# Altium project 200306 Discharge Module R2.PrjPcb
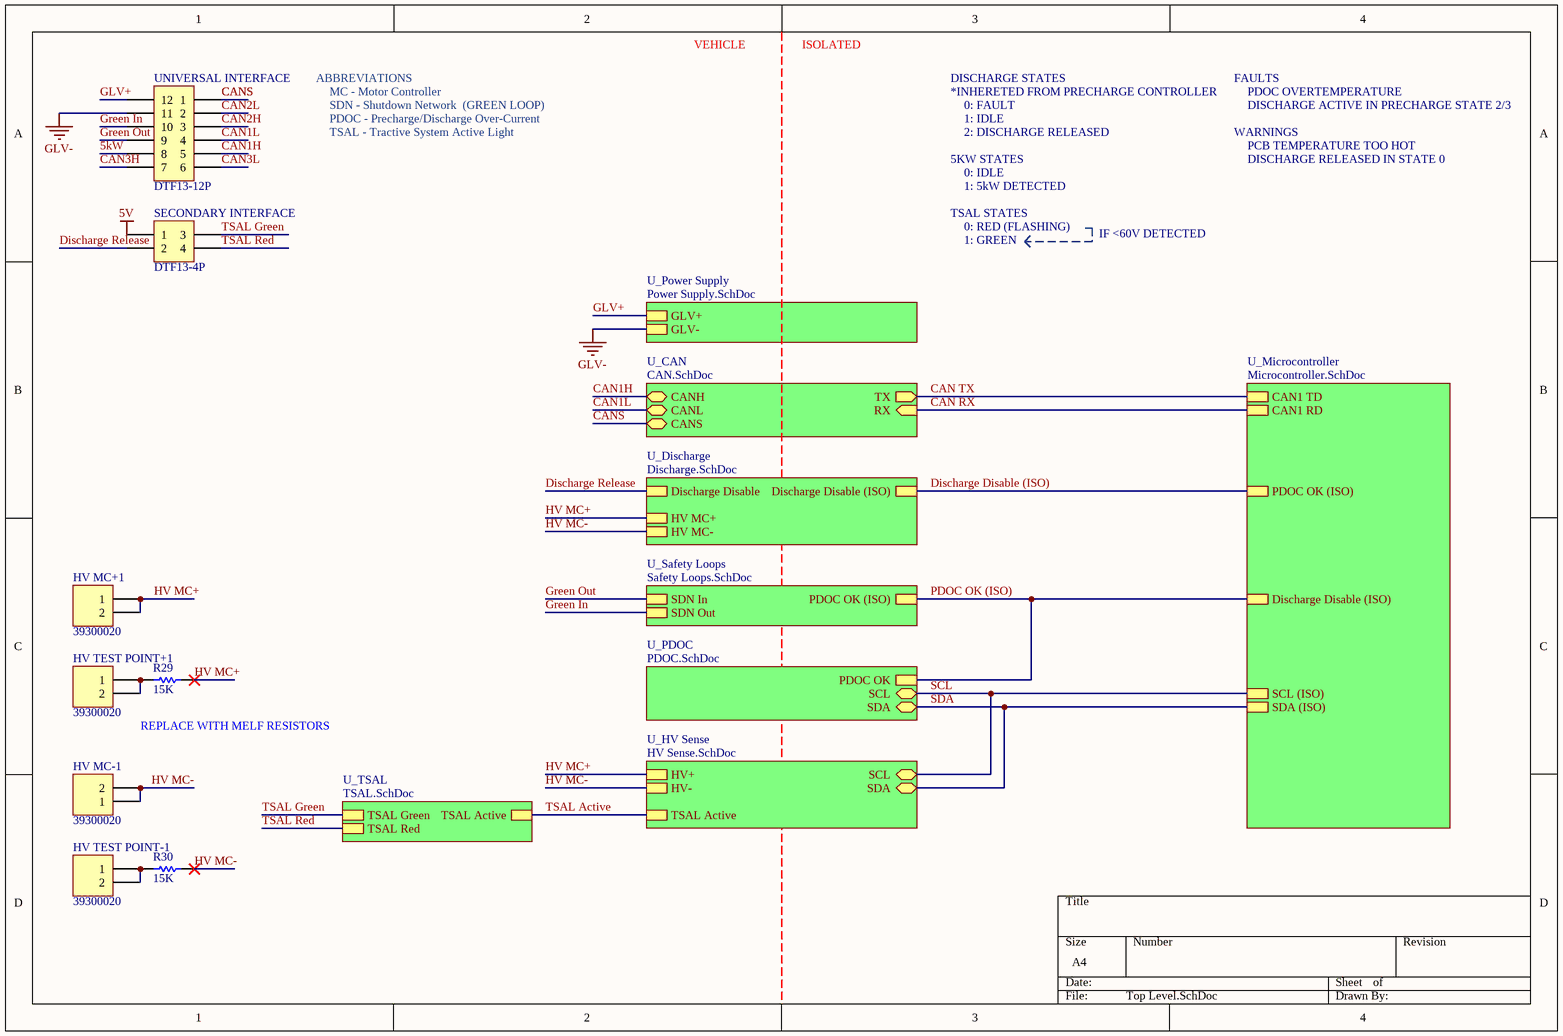
[diagram p0: Top Level.SchDoc]
9 sheets, 198 parts. Net scope: hierarchical (ports join the sheet entries above them; power ports are global).
Board file: PCB.PcbDoc
Sheets:
  Top Level.SchDoc
    U_CAN = CAN.SchDoc
    U_Power Supply = Power Supply.SchDoc
    U_Microcontroller = Microcontroller.SchDoc
    U_TSAL = TSAL.SchDoc
    U_Discharge = Discharge.SchDoc
    U_Safety Loops = Safety Loops.SchDoc
    U_PDOC = PDOC.SchDoc
    U_HV Sense = HV Sense.SchDoc

## Sheet Top Level.SchDoc
size A4

### Parts
HV_MC+1  39300020  [39300020]
HV_MC-1  39300020  [39300020]
HV_TEST_POINT+1  39300020  [39300020]
HV_TEST_POINT-1  39300020  [39300020]
R29  15K  [VB 0204]
R30  15K  [VB 0204]
SECONDARY_INTERFACE  DTF13-4P  [DTF13-4P]
UNIVERSAL_INTERFACE  DTF13-12P  [DTF13-12P]

### Sub-sheets
U_CAN = CAN.SchDoc: CANS (bidir), RX (in), CANL (bidir), CANH (bidir), TX (out)
U_Discharge = Discharge.SchDoc: HV MC+, HV MC-, Discharge Disable, Discharge Disable (ISO)
U_HV Sense = HV Sense.SchDoc: HV+, HV-, SCL (bidir), SDA (bidir), TSAL Active
U_Microcontroller = Microcontroller.SchDoc: CAN1 RD, CAN1 TD, PDOC OK (ISO), Discharge Disable (ISO), SDA (ISO), SCL (ISO)
U_PDOC = PDOC.SchDoc: SCL (bidir), SDA (bidir), PDOC OK
U_Power Supply = Power Supply.SchDoc: GLV+, GLV-
U_Safety Loops = Safety Loops.SchDoc: SDN In, SDN Out, PDOC OK (ISO)
U_TSAL = TSAL.SchDoc: TSAL Active, TSAL Green, TSAL Red

### Nets
5V: SECONDARY_INTERFACE.1
GLV-: UNIVERSAL_INTERFACE.11 ; sheet U_Power Supply/GLV-
HV MC-: HV_MC-1.1 HV_MC-1.2 R30.2 ; sheet U_Discharge/HV MC-, sheet U_HV Sense/HV-
5kW: UNIVERSAL_INTERFACE.8
CAN1H: UNIVERSAL_INTERFACE.5 ; sheet U_CAN/CANH
CAN1L: UNIVERSAL_INTERFACE.4 ; sheet U_CAN/CANL
CAN2H: UNIVERSAL_INTERFACE.3
CAN2L: UNIVERSAL_INTERFACE.2
CAN3H: UNIVERSAL_INTERFACE.7
CAN3L: UNIVERSAL_INTERFACE.6
CAN RX: sheet U_CAN/RX, sheet U_Microcontroller/CAN1 RD
CAN TX: sheet U_CAN/TX, sheet U_Microcontroller/CAN1 TD
CANS: UNIVERSAL_INTERFACE.1 ; sheet U_CAN/CANS
Discharge Disable (ISO): sheet U_Microcontroller/PDOC OK (ISO), sheet U_Discharge/Discharge Disable (ISO)
Discharge Release: SECONDARY_INTERFACE.2 ; sheet U_Discharge/Discharge Disable
GLV+: UNIVERSAL_INTERFACE.12 ; sheet U_Power Supply/GLV+
Green In: UNIVERSAL_INTERFACE.10 ; sheet U_Safety Loops/SDN Out
Green Out: UNIVERSAL_INTERFACE.9 ; sheet U_Safety Loops/SDN In
HV MC+: HV_MC+1.1 HV_MC+1.2 R29.2 ; sheet U_Discharge/HV MC+, sheet U_HV Sense/HV+
PDOC OK (ISO): sheet U_Microcontroller/Discharge Disable (ISO), sheet U_Safety Loops/PDOC OK (ISO), sheet U_PDOC/PDOC OK
SCL: sheet U_Microcontroller/SCL (ISO), sheet U_PDOC/SCL, sheet U_HV Sense/SCL
SDA: sheet U_Microcontroller/SDA (ISO), sheet U_PDOC/SDA, sheet U_HV Sense/SDA
TSAL Active: sheet U_TSAL/TSAL Active, sheet U_HV Sense/TSAL Active
TSAL Green: SECONDARY_INTERFACE.3 ; sheet U_TSAL/TSAL Green
TSAL Red: SECONDARY_INTERFACE.4 ; sheet U_TSAL/TSAL Red
NetHV_TEST_POINT+1_1: HV_TEST_POINT+1.1 HV_TEST_POINT+1.2 R29.1
NetHV_TEST_POINT-1_1: HV_TEST_POINT-1.1 HV_TEST_POINT-1.2 R30.1

### Notes on the sheet
- ABBREVIATIONS
- SDN - Shutdown Network  (GREEN LOOP)
- MC - Motor Controller
- VEHICLE
- ISOLATED
- DISCHARGE STATES
- *INHERETED FROM PRECHARGE CONTROLLER
- 0: FAULT
- FAULTS
- PDOC OVERTEMPERATURE
- DISCHARGE ACTIVE IN PRECHARGE STATE 2/3
- PDOC - Precharge/Discharge Over-Current
- TSAL - Tractive System Active Light
- 5KW STATES
- 1: IDLE
- 2: DISCHARGE RELEASED
- 0: IDLE
- WARNINGS
- PCB TEMPERATURE TOO HOT
- DISCHARGE RELEASED IN STATE 0
- TSAL STATES
- 1: 5kW DETECTED
- 0: RED (FLASHING)
- 1: GREEN
- IF <60V DETECTED
- REPLACE WITH MELF RESISTORS

### Library data of the parts
HV_MC+1 HV_MC-1 HV_TEST_POINT+1 HV_TEST_POINT-1 = 39300020: Positions: 2; Pitch: 4.2mm; Row Spacing: 5.5mm; Angle: 90; Flange: No; Contact: Tin; Part Number: 39300020; Digikey Part Number: WM21351-ND
R29 R30 = MMA02040C1502FB300: Manufacturer: Vishay Beyschlag; Tolerance: 0.01; Rated Voltage: 0.4W; Part Number: MMA02040C1502FB300; Value: 15K; Digikey Part Number: MMA-15KACT-ND
SECONDARY_INTERFACE = DTF13-4P[[/\]]DTF13-4P: Positions: 4; Pitch: 9.12mm; Row Spacing: 4.45mm; Angle: 90; Flange: Yes; Contact: Copper Alloy; Part Number: DTF13-4P; Digikey Part Number: 1734-1646-ND; Digikey Link: https://www.digikey.com.au/products/en?keywords=dtf13-4p
UNIVERSAL_INTERFACE = DTF13-12P[[/\]]DTF13-12P: Positions: 12; Pitch: 4.45mm; Angle: 90; Flange: No; Contact: Copper Alloy; Part Number: DTF13-12P; Row Spacing: 4.45mm; Digikey Part Number: 1734-1861-ND; Digikey Link: https://www.digikey.com/products/en?keywords=dtf13-12pa

## Sheet CAN.SchDoc
size A4
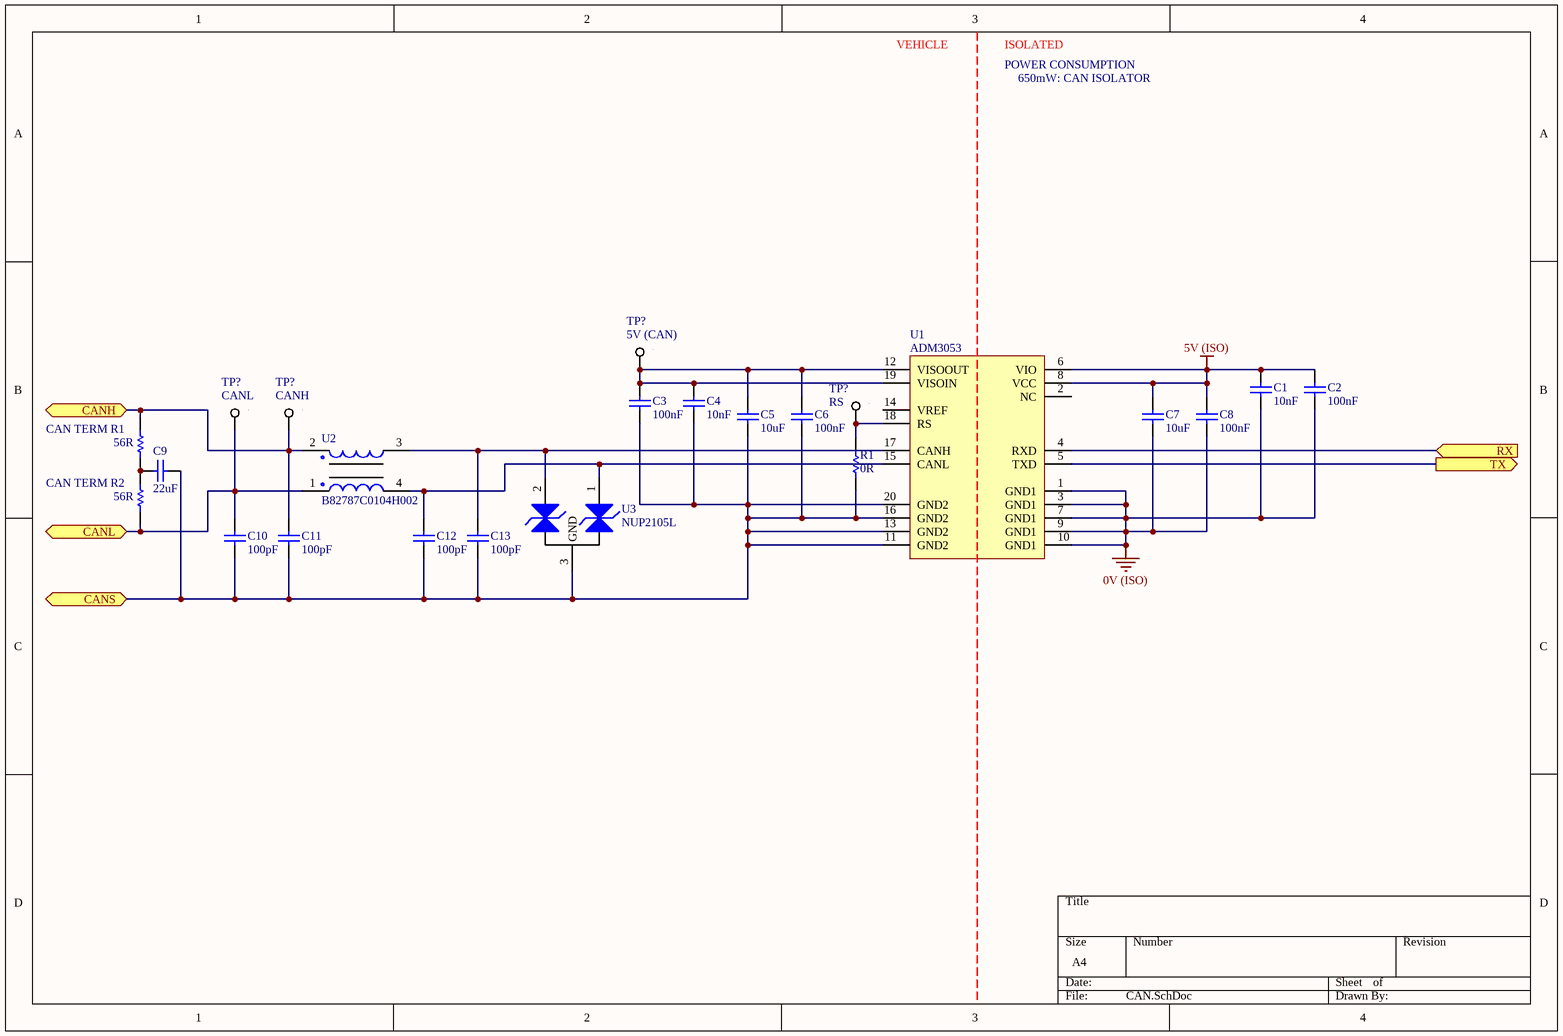
[diagram p1: CAN.SchDoc]

### Parts
(Parts that share a designator on the sheet are numbered #1, #2 ... from top to bottom, then left to right.)
C1  10nF  [1206]
C2  100nF  [0805]
C3  100nF  [0805]
C4  10nF  [1206]
C5  10uF  [0805]
C6  100nF  [0805]
C7  10uF  [0805]
C8  100nF  [0805]
C9  22uF  [1206]
C10  100pF  [0805]
C11  100pF  [0805]
C12  100pF  [0805]
C13  100pF  [0805]
CAN_TERM_R1  56R  [0805]
CAN_TERM_R2  56R  [0805]
R1  0R  [0805]
TP?#1  5V (CAN)  [SMD Test Point 1mm]
TP?#2  RS  [SMD Test Point 1mm]
TP?#3  CANL  [SMD Test Point 1mm]
TP?#4  CANH  [SMD Test Point 1mm]
U1  ADM3053  [AD SOIC-W 20]
U2  B82787C0104H002  [TDK 4-PC Pad]
U3  NUP2105L  [ON SOT-23]

### Ports
CANH (bidir), CANL (bidir), CANS (bidir), RX (in), TX (out)

### Nets
0V (ISO): C1.1 C2.1 C7.1 C8.1 U1.1(GND1) U1.3(GND1) U1.7(GND1) U1.9(GND1) U1.10(GND1)
5V (ISO): C1.2 C2.2 C7.2 C8.2 U1.6(VIO) U1.8(VCC)
CAN1H: C11.2 CAN_TERM_R1.2 TP?#4.1 U2.2 ; port CANH
CAN1L: C10.2 CAN_TERM_R2.1 TP?#3.1 U2.1 ; port CANL
CAN RX: U1.4(RXD) ; port RX
CAN TX: U1.5(TXD) ; port TX
CANS: C3.1 C4.1 C5.1 C6.1 C9.1 C10.1 C11.1 C12.1 C13.1 R1.1 U1.11(GND2) U1.13(GND2) U1.16(GND2) U1.20(GND2) U3.3(GND) ; port CANS
NetC3_2: C3.2 C4.2 C5.2 C6.2 TP?#1.1 U1.12(VISOOUT) U1.19(VISOIN)
NetC9_2: C9.2 CAN_TERM_R1.1 CAN_TERM_R2.2
NetC12_2: C12.2 U1.15(CANL) U2.4 U3.1(CAN_H)
NetC13_2: C13.2 U1.17(CANH) U2.3 U3.2(CAN_L)
NetR1_2: R1.2 TP?#2.1 U1.18(RS)

Not connected (* = marked no-connect by the designer): U1 2(NC) 14(VREF)

### Notes on the sheet
- VEHICLE
- ISOLATED
- POWER CONSUMPTION
- 650mW: CAN ISOLATOR

### Library data of the parts
C1 C4 = GCM3195C2A103JA16D: Manufacturer: muRata; Tolerance: 5%; Material: Ceramic; Rated Voltage: 100V; Part Number: GCM3195C2A103JA16D; Value: 10nF; Digikey Part Number: 490-4978-2-ND
C2 C3 C6 C8 = GCM21BR71H104KA37L: Manufacturer: muRata; Tolerance: ±10%; Material: X7R; Rated Voltage: 50V; Part Number: GCM21BR71H104KA37L; Value: 100nF; Digikey Part Number: 490-6064-1-ND
C5 C7 = GRM21BR6YA106KE43L: Manufacturer: muRata; Tolerance: 10%; Material: X5R; Rated Voltage: 50V; Part Number: GRM21BR6YA106KE43L; Value: 10uF; Digikey Part Number: 490-10514-6-ND
C9 = CC1206MKX5R7BB226: Manufacturer: YAGEO; Tolerance: 20%; Material: Ceramic; Rated Voltage: 16V; Part Number: CC1206MKX5R7BB226; Value: 22uF; Digikey Part Number: 311-1997-2-ND
C10-C13 = GCM2165C1H101JA16D: Manufacturer: muRata; Tolerance: ±5%; Material: C0G, NP0; Rated Voltage: 50V; Part Number: GCM2165C1H101JA16D; Value: 100pF; Digikey Part Number: 490-8031-1-ND
CAN_TERM_R1 CAN_TERM_R2 = RC0805FR0756RL: Manufacturer: YAGEO; Tolerance: 0.01; Rated Voltage: 0.125W; Part Number: RC0805FR0756RL; Value: 56R; Material: FR-07; Digikey Part Number: 311-56.0CRCT-ND
R1 = RC0805FR070RL: Manufacturer: YAGEO; Tolerance: 0.01; Rated Voltage: 0.125W; Part Number: RC0805FR070RL; Value: 0R; Material: FR-07; Digikey Part Number: 311-0.0CRCT-ND
TP?#1-TP?#4 = SMD Test Point Small: Positions: 1; Pitch: 0mm; Row Spacing: 0; Flange: No; Contact: NA; Part Number: SMD Test Point Small; Angle: 0
U1 = ADM3053: Isolated CAN Transceiver; Manufacturer: Analogue Devices; Part Number: ADM3053; Digikey Part Number: ADM3053BRWZ-ND; Digikey Link: https://www.digikey.com/product-detail/en/analog-devices-inc/ADM3053BRWZ/ADM3053BRWZ-ND/2709332
U2 = B82787C0104H002: 100µH @ 100kHz 2 Line Common Mode Choke Surface Mount 5.8 kOhms @ 10MHz 150mA DCR 2Ohm; Manufacturer: EPCOS (TDK); Part Number: B82787C0104H002; Inductance: 100µH @ 100kHz; Impedence: 5.8 kOhms @ 10MHz; Material: Wirewound; Rated Current: 150mA; Digikey Part Number: 495-4598-1-ND; Digikey Link: https://www.digikey.com/product-detail/en/epcos-tdk/B82787C0104H002/495-4598-2-ND/3680998
U3 = NUP2105L: Dual Line CAN Bus Protector; Manufacturer: ON Semiconductor; Part Number: NUP2105L; Digikey Part Number: NUP2105LT1GOSCT-ND; Digikey Link: https://www.digikey.com/product-detail/en/on-semiconductor/NUP2105LT1G/NUP2105LT1GOSCT-ND/1485001

## Sheet Power Supply.SchDoc
size A4
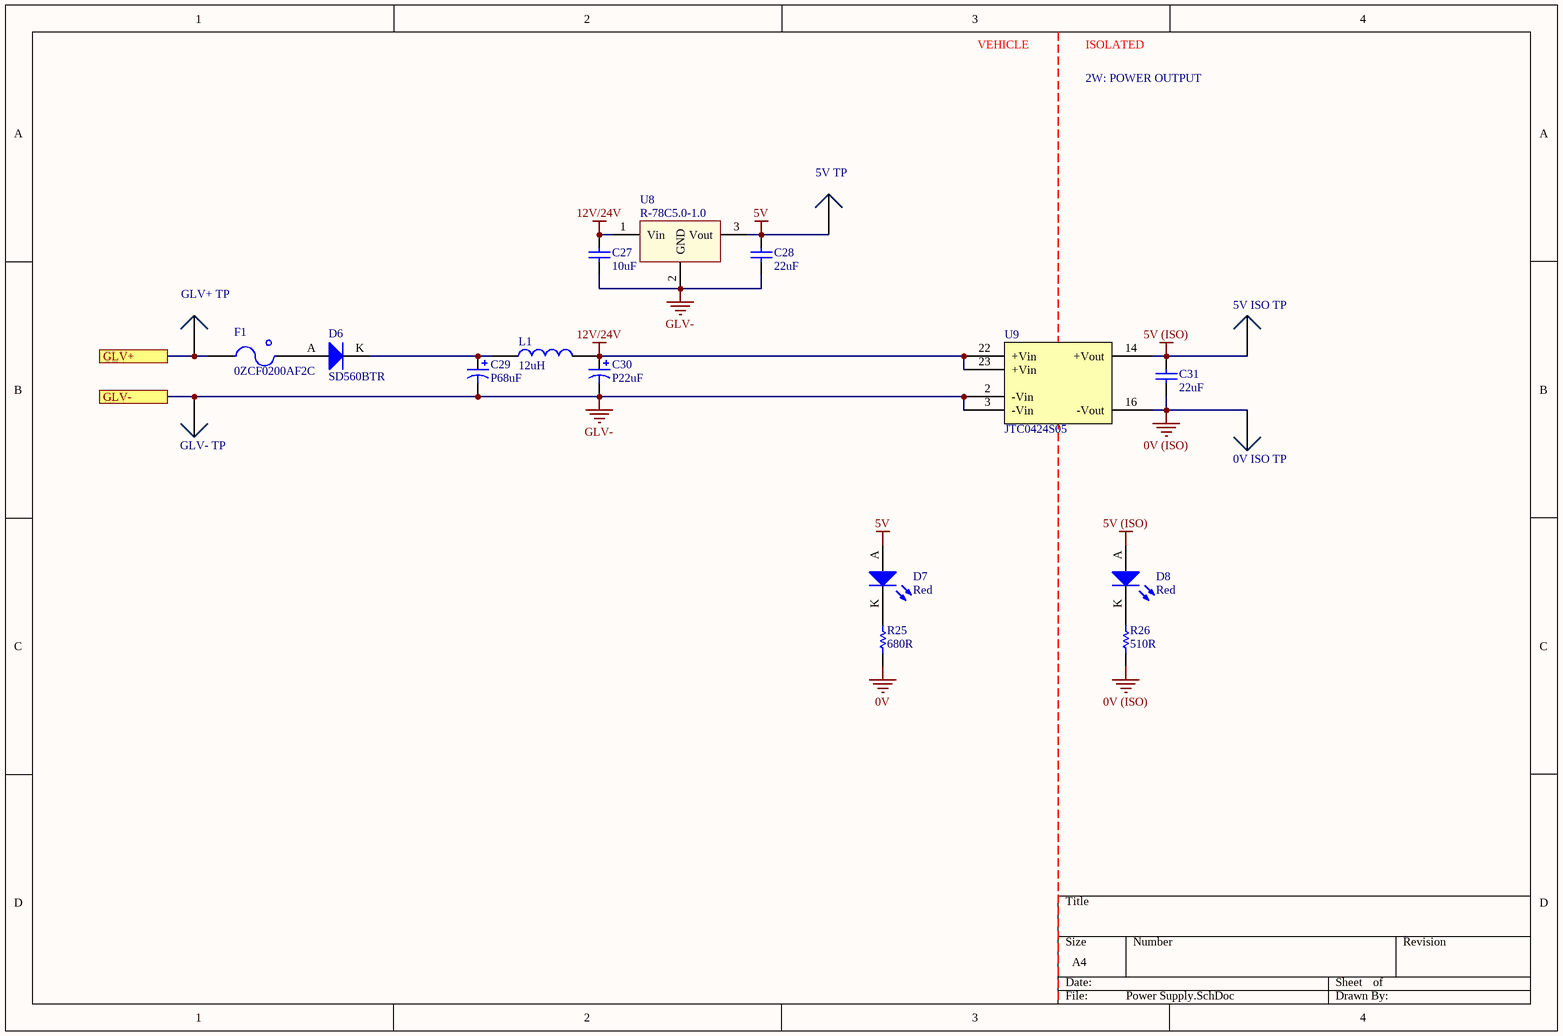
[diagram p2: Power Supply.SchDoc]

### Parts
0V_ISO_TP  0mm  [SMD Test Point]  (value not drawn)
5V_ISO_TP  0mm  [SMD Test Point]  (value not drawn)
5V_TP  0mm  [SMD Test Point]  (value not drawn)
C27  10uF  [0805]
C28  22uF  [1206]
C29  P68uF  [2924]
C30  P22uF  [2924]
C31  22uF  [1206]
D6  SD560BTR  [SMB Diode]
D7  Red  [0805 LED]
D8  Red  [0805 LED]
F1  0ZCF0200AF2C  [2920]
GLV+_TP  0mm  [SMD Test Point]  (value not drawn)
GLV-_TP  0mm  [SMD Test Point]  (value not drawn)
L1  12uH  [1812]
R25  680R  [0805]
R26  510R  [0805]
U8  R-78C5.0-1.0  [RECOM 3-SIP]
U9  JTC0424S05  [24-DIP Module, 7 Leads]

### Ports
GLV+, GLV-

### Nets
0V: R25.1
0V (ISO): 0V_ISO_TP.1 C31.1 R26.1 U9.16(-Vout)
5V: 5V_TP.1 C28.2 D7.A U8.3(Vout)
5V (ISO): 5V_ISO_TP.1 C31.2 D8.A U9.14(+Vout)
12V/24V: C27.2 C30.2 L1.1 U8.1(Vin) U9.22(+Vin) U9.23(+Vin)
GLV-: C27.1 C28.1 C29.1 C30.1 GLV-_TP.1 U8.2(GND) U9.2(-Vin) U9.3(-Vin) ; port GLV-
GLV+: F1.1 GLV+_TP.1 ; port GLV+
NetC29_2: C29.2 D6.K L1.2
NetD6_A: D6.A F1.2
NetD7_K: D7.K R25.2
NetD8_K: D8.K R26.2

### Notes on the sheet
- VEHICLE
- ISOLATED
- 2W: POWER OUTPUT

### Library data of the parts
0V_ISO_TP 5V_ISO_TP 5V_TP GLV+_TP GLV-_TP = SMD Test Point: Positions: 1; Row Spacing: 0; Flange: No; Contact: NA; Part Number: SMD Test Point; Pitch: 0mm; Angle: 0
C27 = GRM21BR6YA106KE43L: as C5 on sheet CAN; Part Number: GRM21BR6YA106KE43L; Value: 10uF; Digikey Part Number: 490-10514-6-ND
C28 C31 = CC1206MKX5R7BB226: as C9 on sheet CAN; Part Number: CC1206MKX5R7BB226; Value: 22uF; Digikey Part Number: 311-1997-2-ND
C29 = TAJV686K035RNJ: Manufacturer: AVX Corporation; Value: 68uF; Tolerance: 10%; Material: Tantalum; Rated Voltage: 35V; Part Number: TAJV686K035RNJ; Digikey Part Number: 478-13135-1-ND
C30 = TAJV226K050RNJ: Manufacturer: AVX Corporation; Value: 22uF; Tolerance: 10%; Material: Tantalum; Rated Voltage: 50V; Part Number: TAJV226K050RNJ; Digikey Part Number: 478-5811-1-ND
D6 = SD560BTR: 1.2V_F 600V 5A SMB; Manufacturer: SMC Diode Solutions; Part Number: SD560BTR; Digikey Part Number: 1655-1530-2-ND; Digikey Link: https://www.digikey.com/product-detail/en/smc-diode-solutions/SD560BTR/1655-1530-2-ND/6022620
D7 D8 = SML-210LTT86: Red LED Indication - Discrete 1.75V 0805 (2012 Metric); Manufacturer: ROHM Semiconductor; Part Number: SML-210LTT86; Colour: Red; Digikey Part Number: 511-1286-1-ND; Digikey Link: https://www.digikey.com/product-detail/en/rohm-semiconductor/SML-210LTT86/511-1286-1-ND/637099
F1 = 0ZCF0200AF2C: SMD 24V 2A Fuse; Manufacturer: Bel Fuse Inc; Part Number: 0ZCF0200AF2C; Digikey Part Number: 507-1749-2-ND; Digikey Link: https://www.digikey.com/product-detail/en/bel-fuse-inc/0ZCF0200AF2C/507-1749-2-ND/4156090
L1 = RLS-126: Manufacturer: Recom; Impedence: 230mOhm; Tolerance: 0.2; Material: Wirewound; Rated Current: 800mA; Part Number: RLS-126; Inductance: 12uH; Digikey Part Number: 945-3429-ND
R25 = RC0805FR07680RL: Manufacturer: YAGEO; Tolerance: 0.01; Rated Voltage: 0.125W; Part Number: RC0805FR07680RL; Value: 680R; Material: FR-07; Digikey Part Number: 311-680CRCT-ND
R26 = RC0805FR07510RL: Manufacturer: YAGEO; Tolerance: 0.01; Rated Voltage: 0.125W; Part Number: RC0805FR07510RL; Value: 510R; Material: FR-07; Digikey Part Number: 311-510CRCT-ND
U8 = R-78C5.0-1.0: CONV DC/DC 1A 5V OUT SIP VERT; Manufacturer: Recom; Isolation: Non-Isolated; Part Number: R-78C5.0-1.0; Digikey Part Number: 945-1395-5-ND; Digikey Link: https://www.digikey.com.au/product-detail/en/recom-power/R-78C5.0-1.0/945-1395-5-ND/2652148
U9 = JTC0424S05: DC DC CONVERTER 5V 4W; Manufacturer: XP Power; Input Voltage: 9V-36V; Efficiency: 0.79; Isolation: Isolated; Part Number: JTC0424S05; Output Voltage: 5V; Output Power: 4W; Digikey Part Number: JTC0424S05-ND; Digikey Link: https://www.digikey.com/products/en?keywords=%20JTC0424S05

## Sheet Microcontroller.SchDoc
size A3
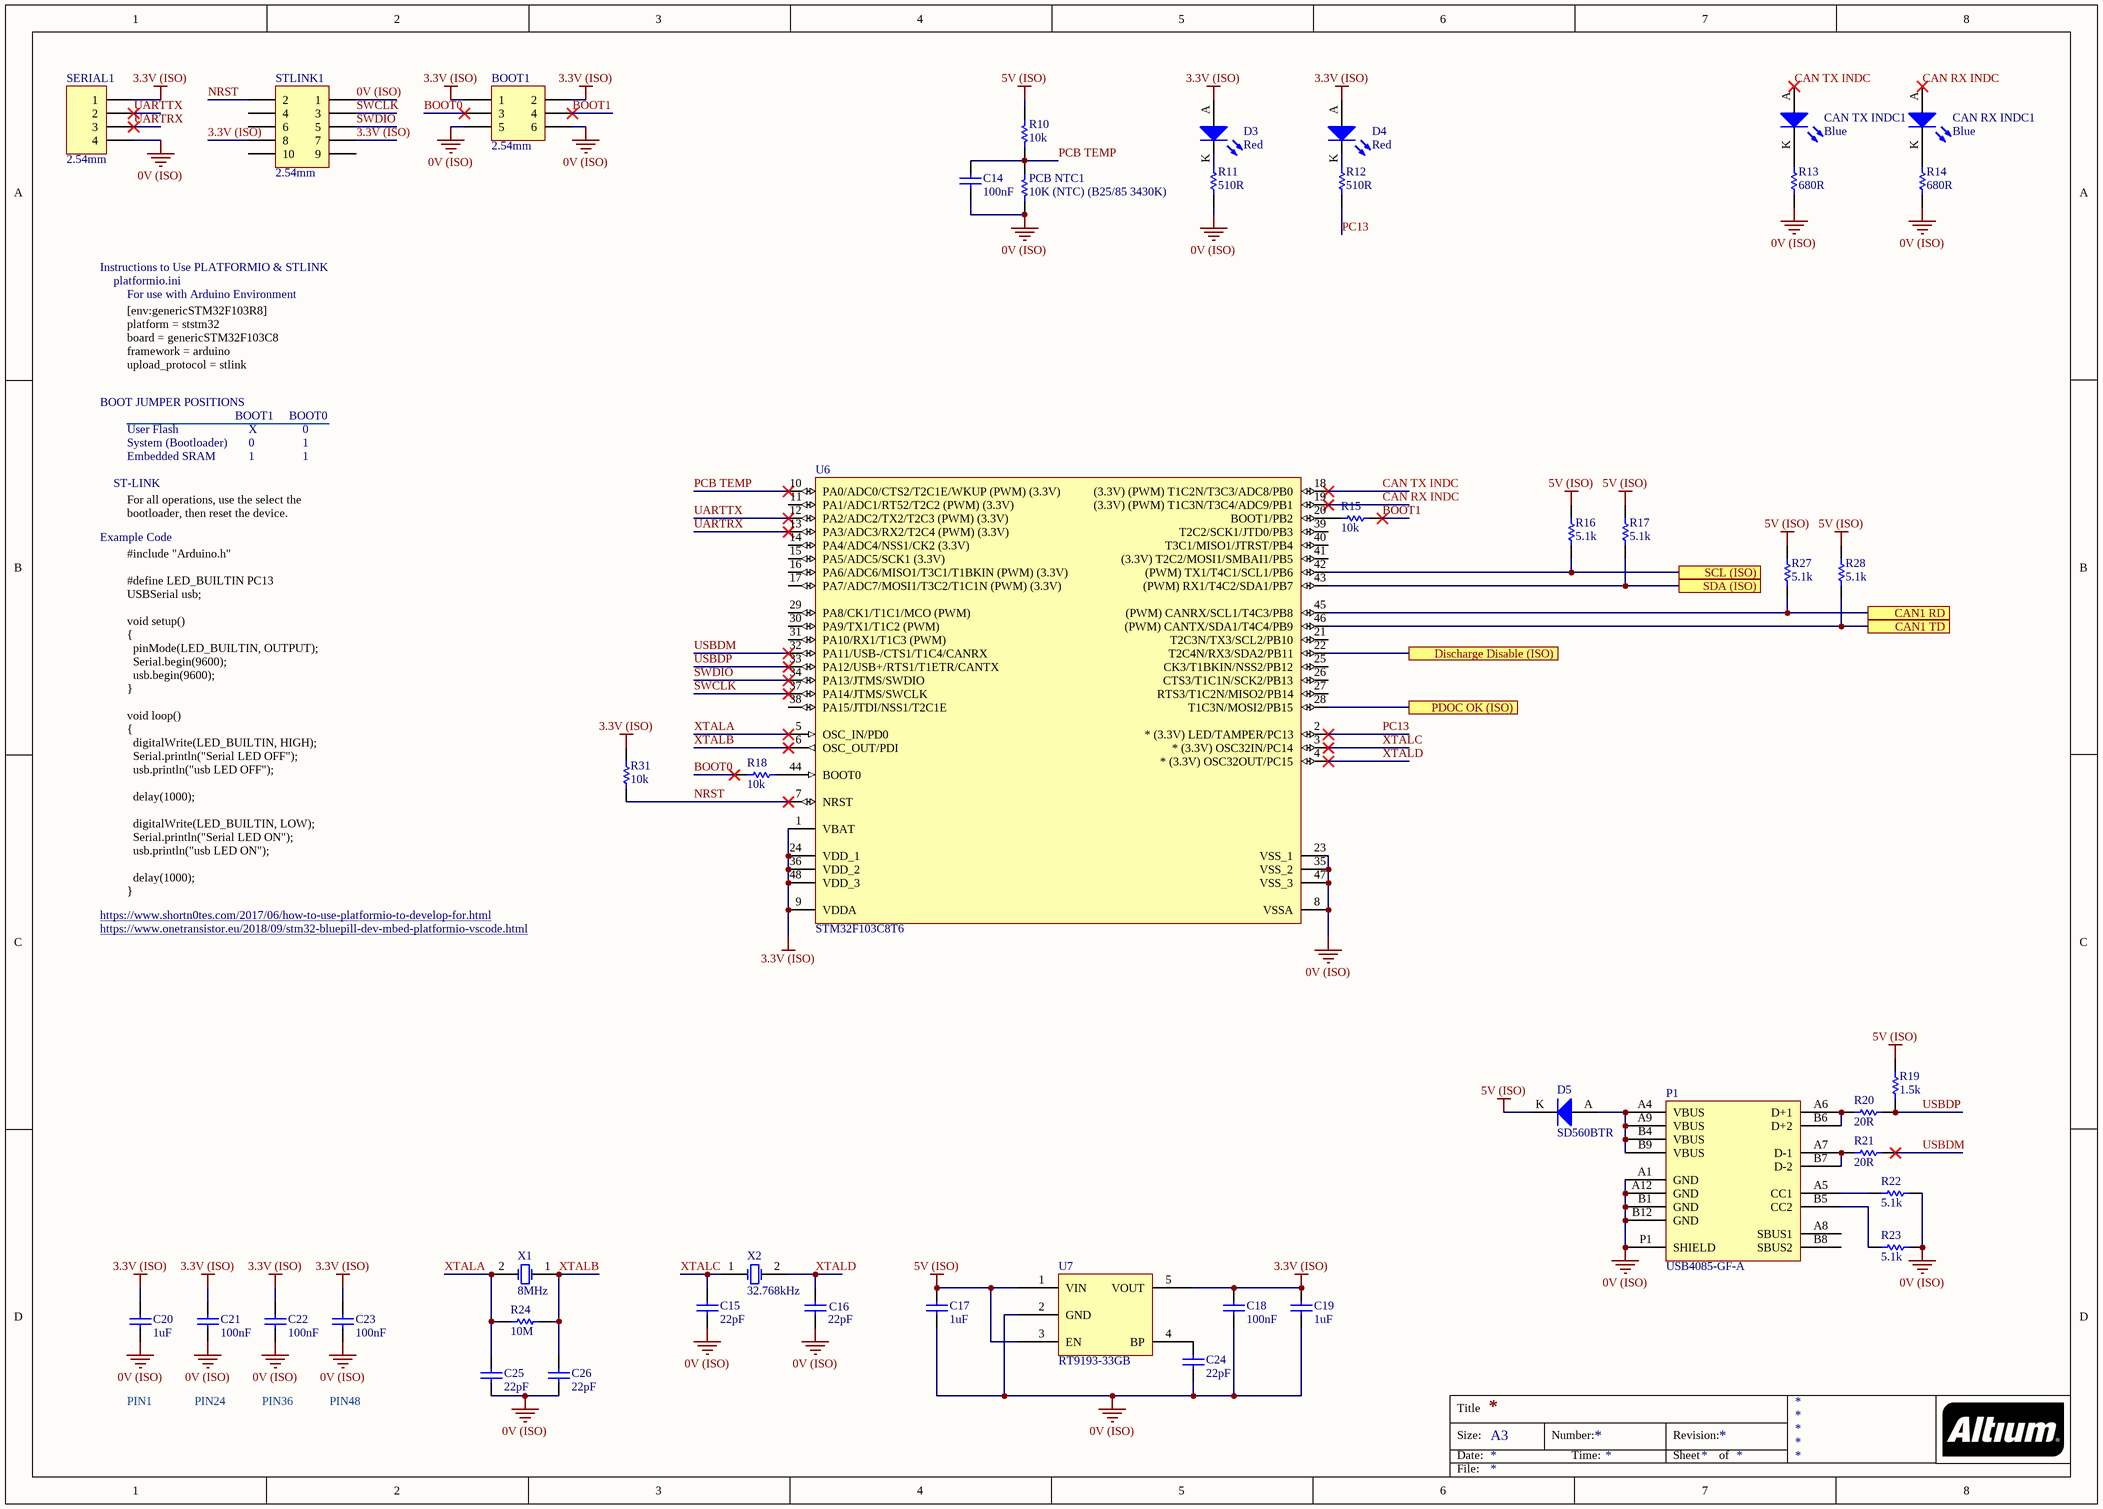
[diagram p3: Microcontroller.SchDoc]

### Parts
BOOT1  2.54mm  [TH 2.54mm Header 2x3]
C14  100nF  [0805]
C15  22pF  [0805]
C16  22pF  [0805]
C17  1uF  [0805]
C18  100nF  [0805]
C19  1uF  [0805]
C20  1uF  [0805]
C21  100nF  [0805]
C22  100nF  [0805]
C23  100nF  [0805]
C24  22pF  [0805]
C25  22pF  [0805]
C26  22pF  [0805]
CAN_RX_INDC1  Blue  [0805 LED]
CAN_TX_INDC1  Blue  [0805 LED]
D3  Red  [0805 LED]
D4  Red  [0805 LED]
D5  SD560BTR  [SMB Diode]
P1  USB4085-GF-A  [USB4085-GF-A]
PCB_NTC1  10K (NTC) (B25/85 3430K)  [0805]
R10  10k  [0805]
R11  510R  [0805]
R12  510R  [0805]
R13  680R  [0805]
R14  680R  [0805]
R15  10k  [0805]
R16  5.1k  [0805]
R17  5.1k  [0805]
R18  10k  [0805]
R19  1.5k  [0805]
R20  20R  [0805]
R21  20R  [0805]
R22  5.1k  [0805]
R23  5.1k  [0805]
R24  10M  [0805]
R27  5.1k  [0805]
R28  5.1k  [0805]
R31  10k  [0805]
SERIAL1  2.54mm  [TH 2.54mm Header 1x4]
STLINK1  2.54mm  [TH 2.54mm Header 2x5]
U6  STM32F103C8T6  [STM 48-LQFP]
U7  RT9193-33GB  [RICHTEK SOT-23-5]
X1  8MHz  [Abracon HC-49/US]
X2  32.768kHz  [EPSON 2-SMD]

### Ports
CAN1 RD, CAN1 TD, Discharge Disable (ISO), PDOC OK (ISO), SCL (ISO), SDA (ISO)

### Nets
0V (ISO): BOOT1.5 BOOT1.6 C14.1 C15.1 C16.1 C17.1 C18.1 C19.1 C20.1 C21.1 C22.1 C23.1 C24.1 C25.1 C26.1 P1.A1(GND) P1.A12(GND) P1.B1(GND) P1.B12(GND) P1.P1(SHIELD) PCB_NTC1.1 R11.1 R13.1 R14.1 R22.2 R23.2 SERIAL1.4 STLINK1.1 U6.8(VSSA) U6.23(VSS_1) U6.35(VSS_2) U6.47(VSS_3) U7.2(GND)
3.3V (ISO): BOOT1.1 BOOT1.2 C18.2 C19.2 C20.2 C21.2 C22.2 C23.2 D3.A D4.A R31.2 SERIAL1.1 STLINK1.7 STLINK1.8 U6.1(VBAT) U6.9(VDDA) U6.24(VDD_1) U6.36(VDD_2) U6.48(VDD_3) U7.5(VOUT)
5V (ISO): C17.2 D5.K R10.2 R16.2 R17.2 R19.2 R27.2 R28.2 U7.1(VIN) U7.3(EN)
BOOT0: BOOT1.3 R18.1
BOOT1: BOOT1.4 R15.2
CAN RX: R27.1 U6.45((PWM)_CANRX/SCL1/T4C3/PB8) ; port CAN1 RD
CAN RX INDC: CAN_RX_INDC1.A U6.19((3.3V)_(PWM)_T1C3N/T3C4/ADC9/PB1)
CAN TX: R28.1 U6.46((PWM)_CANTX/SDA1/T4C4/PB9) ; port CAN1 TD
CAN TX INDC: CAN_TX_INDC1.A U6.18((3.3V)_(PWM)_T1C2N/T3C3/ADC8/PB0)
Discharge Disable (ISO): U6.28(T1C3N/MOSI2/PB15) ; port PDOC OK (ISO)
NRST: R31.1 STLINK1.2 U6.7(NRST)
PC13: R12.1 U6.2(*_(3.3V)_LED/TAMPER/PC13)
PCB TEMP: C14.2 PCB_NTC1.2 R10.1 U6.10(PA0/ADC0/CTS2/T2C1E/WKUP_(PWM)_(3.3V))
PDOC OK (ISO): U6.22(T2C4N/RX3/SDA2/PB11) ; port Discharge Disable (ISO)
SCL: R16.1 U6.42((PWM)_TX1/T4C1/SCL1/PB6) ; port SCL (ISO)
SDA: R17.1 U6.43((PWM)_RX1/T4C2/SDA1/PB7) ; port SDA (ISO)
SWCLK: STLINK1.3 U6.37(PA14/JTMS/SWCLK)
SWDIO: STLINK1.5 U6.34(PA13/JTMS/SWDIO)
UARTRX: SERIAL1.3 U6.13(PA3/ADC3/RX2/T2C4_(PWM)_(3.3V))
UARTTX: SERIAL1.2 U6.12(PA2/ADC2/TX2/T2C3_(PWM)_(3.3V))
USBDM: R21.2 U6.32(PA11/USB-/CTS1/T1C4/CANRX)
USBDP: R19.1 R20.2 U6.33(PA12/USB+/RTS1/T1ETR/CANTX)
XTALA: C25.2 R24.2 U6.5(OSC_IN/PD0) X1.2(OSC2)
XTALB: C26.2 R24.1 U6.6(OSC_OUT/PDI) X1.1(OSC1)
XTALC: C15.2 U6.3(*_(3.3V)_OSC32IN/PC14) X2.1(OSC1)
XTALD: C16.2 U6.4(*_(3.3V)_OSC32OUT/PC15) X2.2(OSC2)
NetC24_2: C24.2 U7.4(BP)
NetCAN_RX_INDC1_K: CAN_RX_INDC1.K R14.2
NetCAN_TX_INDC1_K: CAN_TX_INDC1.K R13.2
NetD3_K: D3.K R11.2
NetD4_K: D4.K R12.2
NetD5_A: D5.A P1.A4(VBUS) P1.A9(VBUS) P1.B4(VBUS) P1.B9(VBUS)
NetP1_A5: P1.A5(CC1) R22.1
NetP1_A6: P1.A6(D+1) P1.B6(D+2) R20.1
NetP1_A7: P1.A7(D-1) P1.B7(D-2) R21.1
NetP1_B5: P1.B5(CC2) R23.1
NetR15_1: R15.1 U6.20(BOOT1/PB2)
NetR18_2: R18.2 U6.44(BOOT0)

Not connected (* = marked no-connect by the designer): P1 A8(SBUS1) B8(SBUS2); STLINK1 4 6 9 10; U6 11(PA1/ADC1/RT52/T2C2_(PWM)_(3.3V)) 14(PA4/ADC4/NSS1/CK2_(3.3V)) 15(PA5/ADC5/SCK1_(3.3V)) 16(PA6/ADC6/MISO1/T3C1/T1BKIN_(PWM)_(3.3V)) 17(PA7/ADC7/MOSI1/T3C2/T1C1N_(PWM)_(3.3V)) 21(T2C3N/TX3/SCL2/PB10) 25(CK3/T1BKIN/NSS2/PB12) 26(CTS3/T1C1N/SCK2/PB13) 27(RTS3/T1C2N/MISO2/PB14) 29(PA8/CK1/T1C1/MCO_(PWM)) 30(PA9/TX1/T1C2_(PWM)) 31(PA10/RX1/T1C3_(PWM)) 38(PA15/JTDI/NSS1/T2C1E) 39(T2C2/SCK1/JTD0/PB3) 40(T3C1/MISO1/JTRST/PB4) 41((3.3V)_T2C2/MOSI1/SMBAI1/PB5)

### Notes on the sheet
- Instructions to Use PLATFORMIO & STLINK
- platformio.ini
- For use with Arduino Environment
- BOOT JUMPER POSITIONS
- [env:genericSTM32F103R8]
  platform = ststm32
  board = genericSTM32F103C8
  framework = arduino
  upload_protocol = stlink
- User Flash
- System (Bootloader)
- BOOT1
- X
- 0
- BOOT0
- 1
- ST-LINK
- Embedded SRAM
- For all operations, use the select the bootloader, then reset the device.
- Example Code
- https://www.shortn0tes.com/2017/06/how-to-use-platformio-to-develop-for.html
- #include "Arduino.h"
  #define LED_BUILTIN PC13
  USBSerial usb;
  void setup()
  {
  pinMode(LED_BUILTIN, OUTPUT);
  Serial.begin(9600);
  usb.begin(9600);
  }
  void loop()
  {
  digitalWrite(LED_BUILTIN, HIGH);
  Serial.println("Serial LED OFF");
  usb.println("usb LED OFF");
  delay(1000);
  digitalWrite(LED_BUILTIN, LOW);
  Serial.println("Serial LED ON");
  usb.println("usb LED ON");
  delay(1000);
  }
- https://www.onetransistor.eu/2018/09/stm32-bluepill-dev-mbed-platformio-vscode.html
- PIN1
- PIN24
- PIN36
- PIN48
- Title
- Size:
- Date:
- A3
- Number:
- Time:
- Revision:
- Sheet
- of
- File:

### Library data of the parts
BOOT1 = TH 2.54mm Header 2x3: Positions: 6; Angle: 0; Flange: No; Contact: NA; Part Number: TH 2.54mm Header 2x3; Pitch: 2.54mm; Row Spacing: 2.54mm
C14 C18 C21-C23 = GCM21BR71H104KA37L: as C2 on sheet CAN; Part Number: GCM21BR71H104KA37L; Value: 100nF; Digikey Part Number: 490-6064-1-ND
C15 C16 C24-C26 = GRM21A5C2E220JW01D: Manufacturer: muRata; Tolerance: ±5%; Material: C0G, NP0; Rated Voltage: 250V; Part Number: GRM21A5C2E220JW01D; Value: 22pF; Digikey Part Number: 490-5534-1-ND
C17 C19 C20 = AC0805KKX7R8BB105: Manufacturer: YAGEO; Tolerance: 10%; Material: X7R; Rated Voltage: 25V; Part Number: AC0805KKX7R8BB105; Value: 1uF
CAN_RX_INDC1 CAN_TX_INDC1 = SML-MN2BCTT86C: LED BLUE CLEAR 2012 SMD; Manufacturer: ROHM Semiconductor; Part Number: SML-MN2BCTT86C; Colour: Blue; Digikey Part Number: 846-1207-1-ND; Digikey Link: https://www.digikey.com/product-detail/en/rohm-semiconductor/SMLMN2BCTT86C/846-1207-1-ND/6057239
D3 D4 = SML-210LTT86: as D7 on sheet Power Supply; Part Number: SML-210LTT86; Colour: Red; Digikey Part Number: 511-1286-1-ND; Digikey Link: https://www.digikey.com/product-detail/en/rohm-semiconductor/SML-210LTT86/511-1286-1-ND/637099
D5 = SD560BTR: as D6 on sheet Power Supply; Part Number: SD560BTR; Digikey Part Number: 1655-1530-2-ND; Digikey Link: https://www.digikey.com/product-detail/en/smc-diode-solutions/SD560BTR/1655-1530-2-ND/6022620
P1 = USB4085-GF-A: USB - C (Type - C) USB 2.0 Receptacle Connector 16 Position Through Hole, Right Angle; Angle: 90; Part Number: USB4085-GF-A; Digikey Part Number: 2073-USB4085-GF-ACT-ND; Digikey Link: https://www.digikey.ee/product-detail/en/gct/USB4085-GF-A/2073-USB4085-GF-ACT-ND/9859733
PCB_NTC1 = NTCS0805E3103FLT: Manufacturer: Vishay Beyschlag; Tolerance: 0.01; Rated Voltage: 210mW; Part Number: NTCS0805E3103FLT; Value: 10K (NTC) (B25/85 3430K); Digikey Part Number: BC2733CT-ND
R10 R15 R18 R31 = RC0805FR0710KL: Manufacturer: YAGEO; Tolerance: 0.01; Rated Voltage: 0.125W; Part Number: RC0805FR0710KL; Value: 10k; Material: FR-07; Digikey Part Number: 311-10.0KCRCT-ND
R11 R12 = RC0805FR07510RL: as R26 on sheet Power Supply; Part Number: RC0805FR07510RL; Value: 510R; Material: FR-07; Digikey Part Number: 311-510CRCT-ND
R13 R14 = RC0805FR07680RL: as R25 on sheet Power Supply; Part Number: RC0805FR07680RL; Value: 680R; Material: FR-07; Digikey Part Number: 311-680CRCT-ND
R16 R17 R22 R23 R27 R28 = RC0805FR075K1L: Manufacturer: YAGEO; Tolerance: 0.01; Rated Voltage: 0.125W; Part Number: RC0805FR075K1L; Value: 5.1k; Material: FR-07; Digikey Part Number: 311-5.10KCRCT-ND
R19 = RC0805FR071K5L: Manufacturer: YAGEO; Tolerance: 0.01; Rated Voltage: 0.125W; Part Number: RC0805FR071K5L; Value: 1.5k; Material: FR-07; Digikey Part Number: 311-1.50KCRCT-ND
R20 R21 = RC0805FR0720RL: Manufacturer: YAGEO; Tolerance: 0.01; Rated Voltage: 0.125W; Part Number: RC0805FR0720RL; Value: 20R; Material: FR-07; Digikey Part Number: 311-20.0CRCT-ND
R24 = RC0805FR0710ML: Manufacturer: YAGEO; Tolerance: 0.01; Rated Voltage: 0.125W; Part Number: RC0805FR0710ML; Value: 10M; Material: FR-07; Digikey Part Number: 311-10.0MCRCT-ND
SERIAL1 = TH 2.54mm Header 1x4: Positions: 4; Angle: 0; Flange: No; Contact: NA; Part Number: TH 2.54mm Header 1x4; Pitch: 2.54mm; Row Spacing: 2.54mm
STLINK1 = TH 2.54mm Header 2x5: Positions: 10; Angle: 0; Flange: No; Contact: NA; Part Number: TH 2.54mm Header 2x5; Pitch: 2.54mm; Row Spacing: 2.54mm
U6 = STM32F103C8T6: ARM® Cortex®-M3 STM32F1 Microcontroller IC 32-Bit 72MHz 64KB (64K x 8) FLASH; Manufacturer: STMicroelectronics; Part Number: STM32F103C8T6; Digikey Part Number: 497-6063-ND; Digikey Link: https://www.digikey.com/product-detail/en/stmicroelectronics/STM32F103C8T6/497-6063-ND/1646338
U7 = RT9193-33GB: IC REG LINEAR 3.3V 300MA SOT23-5; Manufacturer: Richtek; Part Number: RT9193-33GB; Digikey Part Number: 1028-1014-1-ND; Digikey Link: https://www.digikey.com/products/en?keywords=1028-1014-1-ND
X1 = ABLS-8.000MHZ-B4-T: Manufacturer: Abracon LLC; Load Capacitance: 18pF; ESR: 80R; Part Number: ABLS-8.000MHZ-B4-T; Value: 8MHz; Digikey Part Number: 535-10212-2-ND; Digikey Link: https://www.digikey.com/product-detail/en/abracon-llc/ABLS-8.000MHZ-B4-T/535-10212-2-ND/2184155
X2 = FC-135 32.7680KA-A5: Manufacturer: EPSON; Load Capacitance: 12.5pF; ESR: 70k; Part Number: FC-135 32.7680KA-A5; Value: 32.768kHz; Digikey Part Number: SER4103TR-ND; Digikey Link: https://www.digikey.com/product-detail/en/epson/FC-135-32.7680KA-A5/SER4103TR-ND/5259895

## Sheet TSAL.SchDoc
size A4
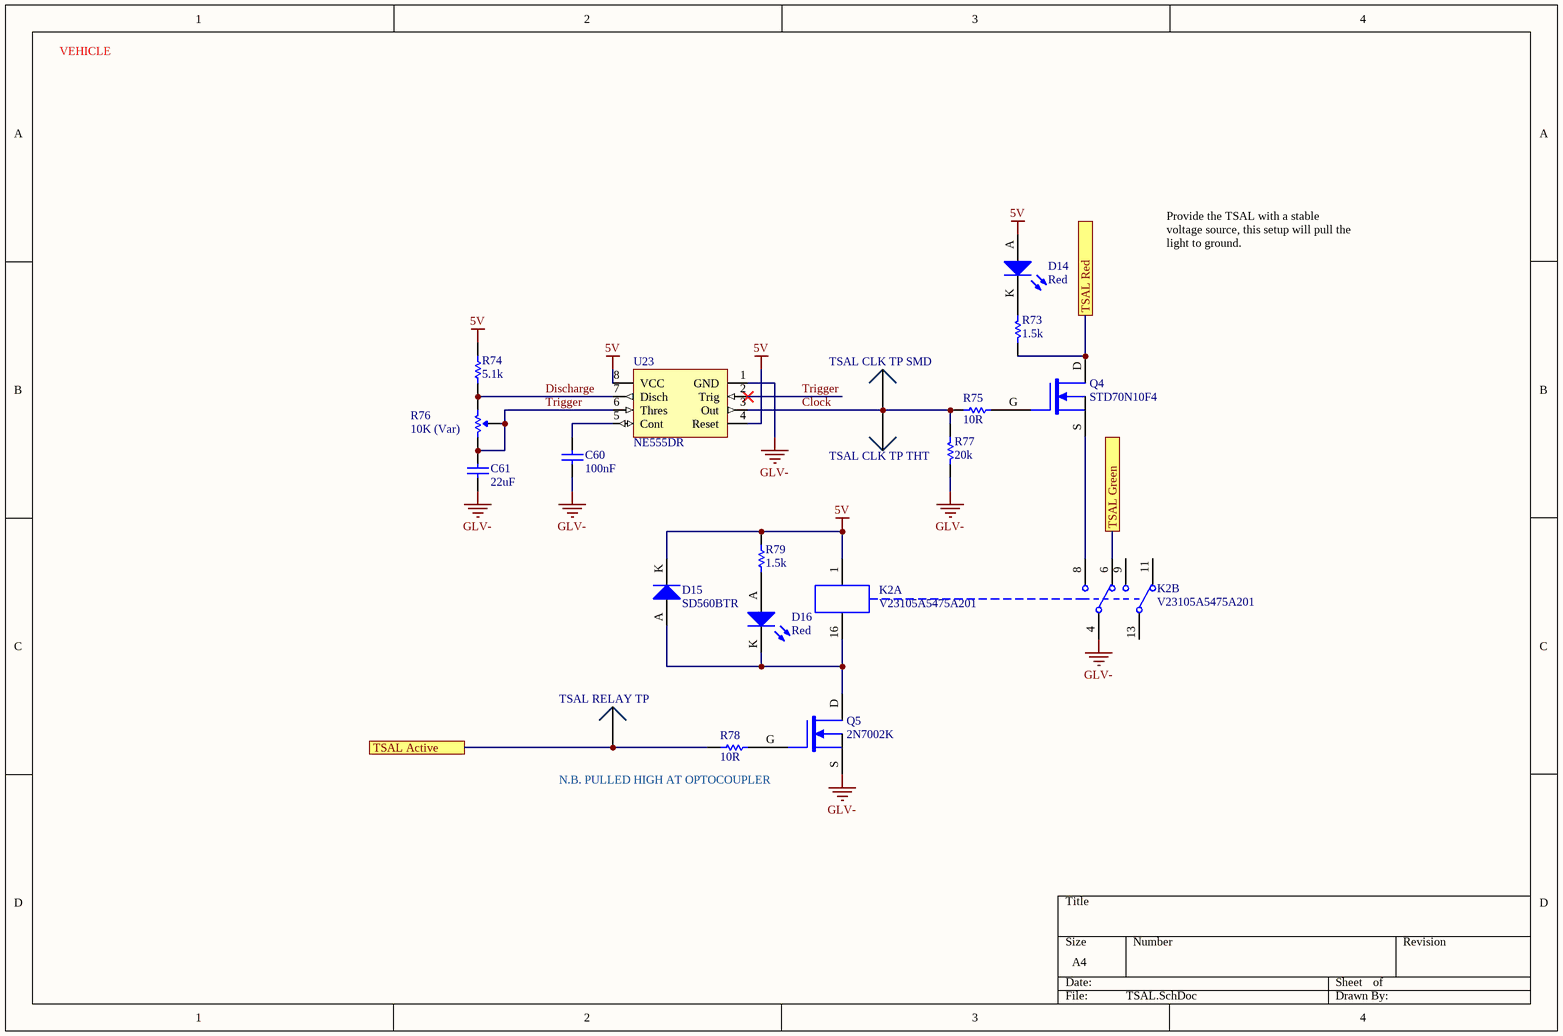
[diagram p4: TSAL.SchDoc]

### Parts
C60  100nF  [0805]
C61  22uF  [1206]
D14  Red  [0805 LED]
D15  SD560BTR  [SMB Diode]
D16  Red  [0805 LED]
K2  V23105A5475A201  [TI 2-DIL]  (parts A,B of 2)
Q4  STD70N10F4  [STM TO-252 MOSFET]
Q5  2N7002K  [ON SOT-23 MOSFET]
R73  1.5k  [0805]
R74  5.1k  [0805]
R75  10R  [0805]
R76  10K (Var)  [B 3296]
R77  20k  [0805]
R78  10R  [0805]
R79  1.5k  [0805]
TSAL_CLK_TP_SMD  0mm  [SMD Test Point]  (value not drawn)
TSAL_CLK_TP_THT  0mm  [TH Test Point]  (value not drawn)
TSAL_RELAY_TP  0mm  [SMD Test Point]  (value not drawn)
U23  NE555DR  [TI 8-SOIC]

### Ports
TSAL Active, TSAL Green, TSAL Red

### Nets
5V: D14.A D15.K K2.1 R74.2 R79.2 U23.4(Reset) U23.8(VCC)
GLV-: C60.1 C61.1 K2.4 Q5.S R77.1 U23.1(GND)
Clock: R75.1 R77.2 TSAL_CLK_TP_SMD.1 TSAL_CLK_TP_THT.1 U23.3(Out)
Discharge: R74.1 R76.3(CW) U23.7(Disch)
Trigger: C61.2 R76.1(CCW) R76.2(Wiper) U23.2(Trig) U23.6(Thres)
TSAL Active: R78.1 TSAL_RELAY_TP.1 ; port TSAL Active
TSAL Green: K2.6 ; port TSAL Green
TSAL Red: Q4.D R73.1 ; port TSAL Red
NetC60_2: C60.2 U23.5(Cont)
NetD14_K: D14.K R73.2
NetD15_A: D15.A D16.K K2.16 Q5.D
NetD16_A: D16.A R79.1
NetK2_8: K2.8 Q4.S
NetQ4_G: Q4.G R75.2
NetQ5_G: Q5.G R78.2

Not connected (* = marked no-connect by the designer): K2 9 11 13

### Notes on the sheet
- VEHICLE
- Provide the TSAL with a stable voltage source, this setup will pull the light to ground.
- (near R78) N.B. PULLED HIGH AT OPTOCOUPLER

### Library data of the parts
C60 = GCM21BR71H104KA37L: as C2 on sheet CAN; Part Number: GCM21BR71H104KA37L; Value: 100nF; Digikey Part Number: 490-6064-1-ND
C61 = CC1206MKX5R7BB226: as C9 on sheet CAN; Part Number: CC1206MKX5R7BB226; Value: 22uF; Digikey Part Number: 311-1997-2-ND
D14 D16 = SML-210LTT86: as D7 on sheet Power Supply; Part Number: SML-210LTT86; Colour: Red; Digikey Part Number: 511-1286-1-ND; Digikey Link: https://www.digikey.com/product-detail/en/rohm-semiconductor/SML-210LTT86/511-1286-1-ND/637099
D15 = SD560BTR: as D6 on sheet Power Supply; Part Number: SD560BTR; Digikey Part Number: 1655-1530-2-ND; Digikey Link: https://www.digikey.com/product-detail/en/smc-diode-solutions/SD560BTR/1655-1530-2-ND/6022620
K2 = V23105A5475A201: 5V DPDT Relay 3A 220VDC; Manufacturer: Axicom; Part Number: V23105A5475A201; Digikey Part Number: PB383-ND; Digikey Link: https://www.digikey.com/products/en?mpart=V23105A5001A201&v=41
Q4 = STD70N10F4: N-Channel 100V 60A (Tc) 125W (Tc) Surface Mount DPAK; Manufacturer: STMicroelectronics; Published: 24-Mar-1999; LatestRevisionDate: 29-May-2009; LatestRevisionNote: IPC-7351 Footprint Added.; PackageVersion: Sep-2000; PackageReference: SOT-343; Publisher: Altium Limited; PackageDescription: 4-Pin SOT-343 Package 1.3 mm Pitch, 2.1 mm Lead Span; Part Number: STD70N10F4; Digikey Part Number: 497-8806-2-ND; Digikey Link: https://www.digikey.com/product-detail/en/stmicroelectronics/STD70N10F4/497-8806-2-ND/2035599
Q5 = 2N7002K: 60V 380mA, NFET MOSTFET (Small Signal); Manufacturer: ON Semiconductor; Published: 24-Mar-1999; LatestRevisionDate: 29-May-2009; LatestRevisionNote: IPC-7351 Footprint Added.; PackageVersion: Sep-2000; PackageReference: SOT-343; Publisher: Altium Limited; PackageDescription: 4-Pin SOT-343 Package 1.3 mm Pitch, 2.1 mm Lead Span; Part Number: 2N7002K; Digikey Part Number: 2N7002KCT-ND; Digikey Link: https://www.digikey.com/product-detail/en/on-semiconductor/2N7002K/2N7002KCT-ND/2060375; Qty: 30
R73 R79 = RC0805FR071K5L: as R19 on sheet Microcontroller; Part Number: RC0805FR071K5L; Value: 1.5k; Material: FR-07; Digikey Part Number: 311-1.50KCRCT-ND
R74 = RC0805FR075K1L: as R16 on sheet Microcontroller; Part Number: RC0805FR075K1L; Value: 5.1k; Material: FR-07; Digikey Part Number: 311-5.10KCRCT-ND
R75 R78 = RC0805FR0710RL: Manufacturer: YAGEO; Tolerance: 0.01; Rated Voltage: 0.125W; Part Number: RC0805FR0710RL; Value: 10R; Material: FR-07; Digikey Part Number: 311-10.0CRCT-ND
R76 = 3296W-1-103LF: Manufacturer: Bournes Inc; Tolerance: 0.1; Rated Voltage: 0.5W; Part Number: 3296W-1-103LF; Value: 10K (Var); Digikey Part Number: 3296W-103LF-ND
R77 = RC0805FR0720KL: Manufacturer: YAGEO; Tolerance: 0.01; Rated Voltage: 0.125W; Part Number: RC0805FR0720KL; Value: 20k; Material: FR-07; Digikey Part Number: 311-20.0KCRCT-ND
TSAL_CLK_TP_SMD TSAL_RELAY_TP = SMD Test Point: as 0V_ISO_TP on sheet Power Supply; Part Number: SMD Test Point; Pitch: 0mm; Angle: 0
TSAL_CLK_TP_THT = TH Test Point: Positions: 1; Angle: 0; Flange: No; Contact: NA; Part Number: TH Test Point; Pitch: 0mm; Row Spacing: 0mm
U23 = NE555DR: IC OSC SGL TIMER 100KHZ 8-SOIC; Manufacturer: Texas Instruments; Part Number: NE555DR; Digikey Part Number: 296-6501-1-ND; Digikey Link: https://www.digikey.com.au/product-detail/en/texas-instruments/NE555DR/296-6501-1-ND/372490

## Sheet Discharge.SchDoc
size A4
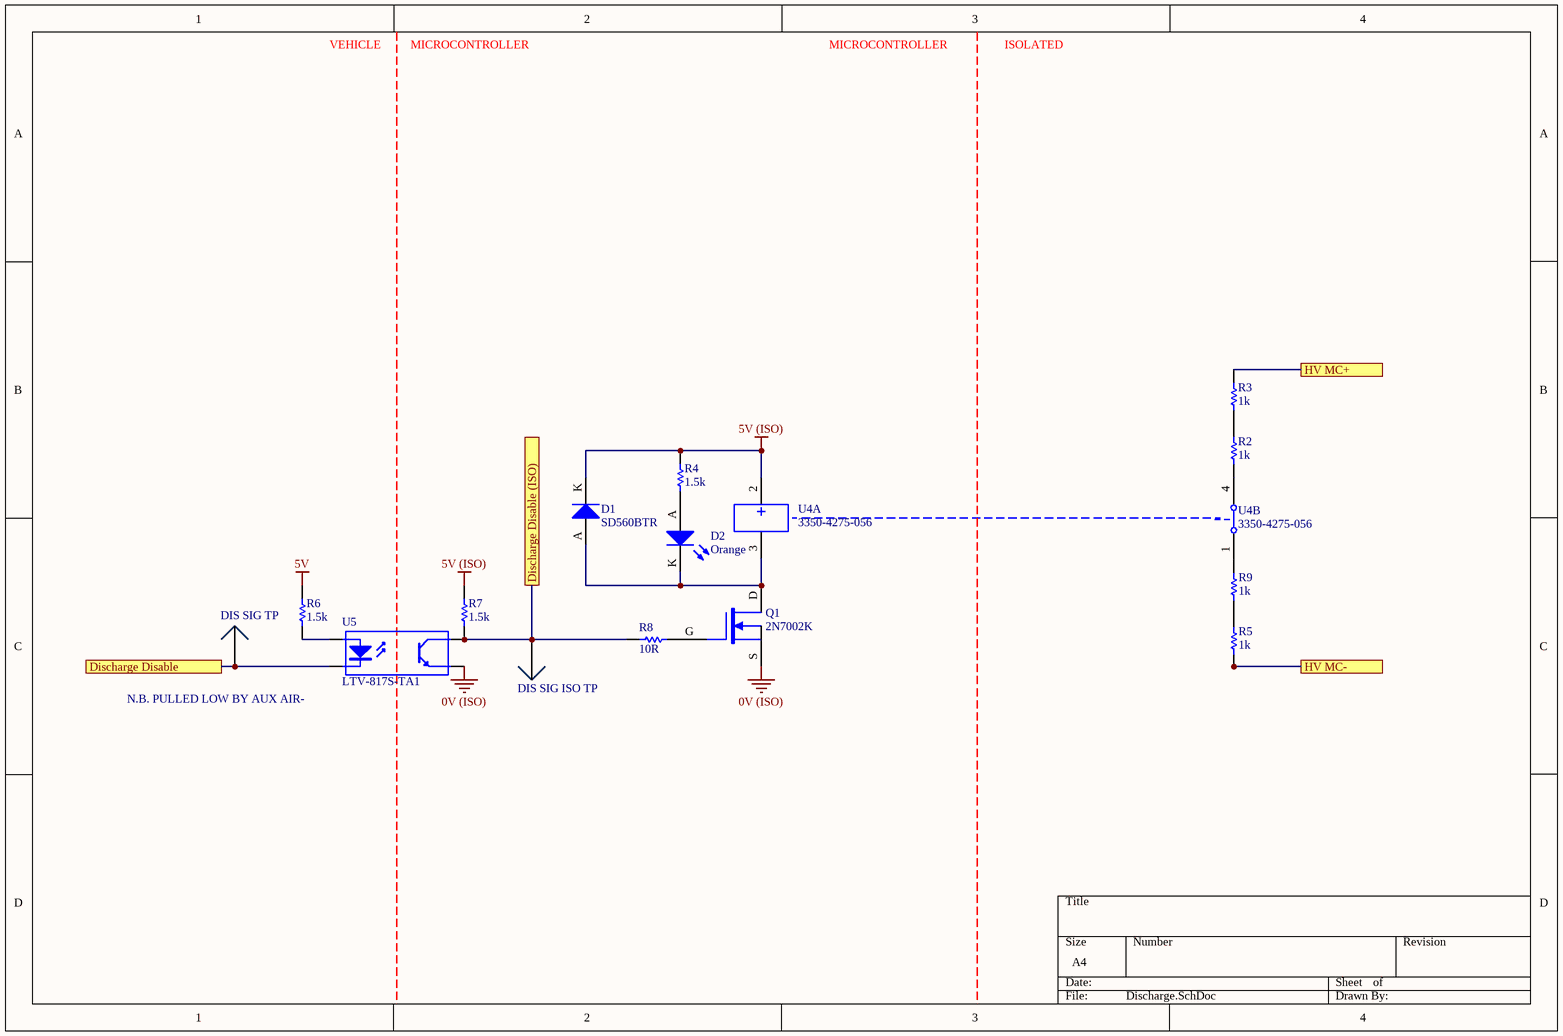
[diagram p5: Discharge.SchDoc]

### Parts
D1  SD560BTR  [SMB Diode]
D2  Orange  [0805 LED]
DIS_SIG_ISO_TP  0mm  [SMD Test Point]  (value not drawn)
DIS_SIG_TP  0mm  [SMD Test Point]  (value not drawn)
Q1  2N7002K  [ON SOT-23 MOSFET]
R2  1k  [B TO-263]
R3  1k  [B TO-263]
R4  1.5k  [0805]
R5  1k  [B TO-263]
R6  1.5k  [0805]
R7  1.5k  [0805]
R8  10R  [0805]
R9  1k  [B TO-263]
U4  3350-4275-056  [CI SPST]  (parts A,B of 2)
U5  LTV-817S-TA1  [ON 4-SMD]

### Ports
Discharge Disable, Discharge Disable (ISO), HV MC+, HV MC-

### Nets
0V (ISO): Q1.S U5.3(E)
5V: R6.2
5V (ISO): D1.K R4.2 R7.2 U4.2
HV MC-: R5.2 ; port HV MC-
Discharge Disable (ISO): DIS_SIG_ISO_TP.1 R7.1 R8.1 U5.4(C) ; port Discharge Disable (ISO)
Discharge Release: DIS_SIG_TP.1 U5.2(K) ; port Discharge Disable
HV MC+: R3.1 ; port HV MC+
NetD1_A: D1.A D2.K Q1.D U4.3
NetD2_A: D2.A R4.1
NetQ1_G: Q1.G R8.2
NetR2_1: R2.1 R3.2
NetR2_2: R2.2 U4.4
NetR5_1: R5.1 R9.2
NetR6_1: R6.1 U5.1(A)
NetR9_1: R9.1 U4.1

### Notes on the sheet
- VEHICLE
- MICROCONTROLLER
- ISOLATED
- N.B. PULLED LOW BY AUX AIR-

### Library data of the parts
D1 = SD560BTR: as D6 on sheet Power Supply; Part Number: SD560BTR; Digikey Part Number: 1655-1530-2-ND; Digikey Link: https://www.digikey.com/product-detail/en/smc-diode-solutions/SD560BTR/1655-1530-2-ND/6022620
D2 = SML-211DTT86: Orange LED Indication - Discrete 1.75V 0805 (2012 Metric); Manufacturer: ROHM Semiconductor; Part Number: SML-211DTT86; Colour: Orange; Digikey Part Number: 511-1291-1-ND; Digikey Link: https://www.digikey.com/product-detail/en/rohm-semiconductor/SML-211DTT86/511-1291-1-ND/637104
DIS_SIG_ISO_TP DIS_SIG_TP = SMD Test Point: as 0V_ISO_TP on sheet Power Supply; Part Number: SMD Test Point; Pitch: 0mm; Angle: 0
Q1 = 2N7002K: as Q5 on sheet TSAL; Published: 24-Mar-1999; LatestRevisionDate: 29-May-2009; LatestRevisionNote: IPC-7351 Footprint Added.; PackageVersion: Sep-2000; PackageReference: SOT-343; Publisher: Altium Limited; PackageDescription: 4-Pin SOT-343 Package 1.3 mm Pitch, 2.1 mm Lead Span; Part Number: 2N7002K; Digikey Part Number: 2N7002KCT-ND; Digikey Link: https://www.digikey.com/product-detail/en/on-semiconductor/2N7002K/2N7002KCT-ND/2060375; Qty: 30
R2 R3 R5 R9 = PWR263S-35-1001J: Manufacturer: Bournes Inc; Tolerance: 0.05; Rated Voltage: 35W; Part Number: PWR263S-35-1001J; Value: 1k; Digikey Part Number: PWR263S-35-1001J-ND
R4 R6 R7 = RC0805FR071K5L: as R19 on sheet Microcontroller; Part Number: RC0805FR071K5L; Value: 1.5k; Material: FR-07; Digikey Part Number: 311-1.50KCRCT-ND
R8 = RC0805FR0710RL: as R75 on sheet TSAL; Part Number: RC0805FR0710RL; Value: 10R; Material: FR-07; Digikey Part Number: 311-10.0CRCT-ND
U4 = 3350-4275-056: RELAY REED HV SPST 200W 3A 5V (NC); Manufacturer: Comus International; Part Number: 3350-4275-056; Digikey Part Number: 1835-1039-ND; Digikey Link: https://www.digikey.com.au/product-detail/en/comus-international/3350-4275-056/1835-1039-ND/7515921
U5 = LTV-817S-TA1: 35V 50ma Optocoupler (VF=1.2V); Manufacturer: Lite-On Inc; Part Number: LTV-817S-TA1; Digikey Part Number: 160-1893-2-ND; Digikey Link: https://www.digikey.com/product-detail/en/lite-on-inc/LTV-817S-TA1/160-1893-2-ND/388451

## Sheet Safety Loops.SchDoc
size A4
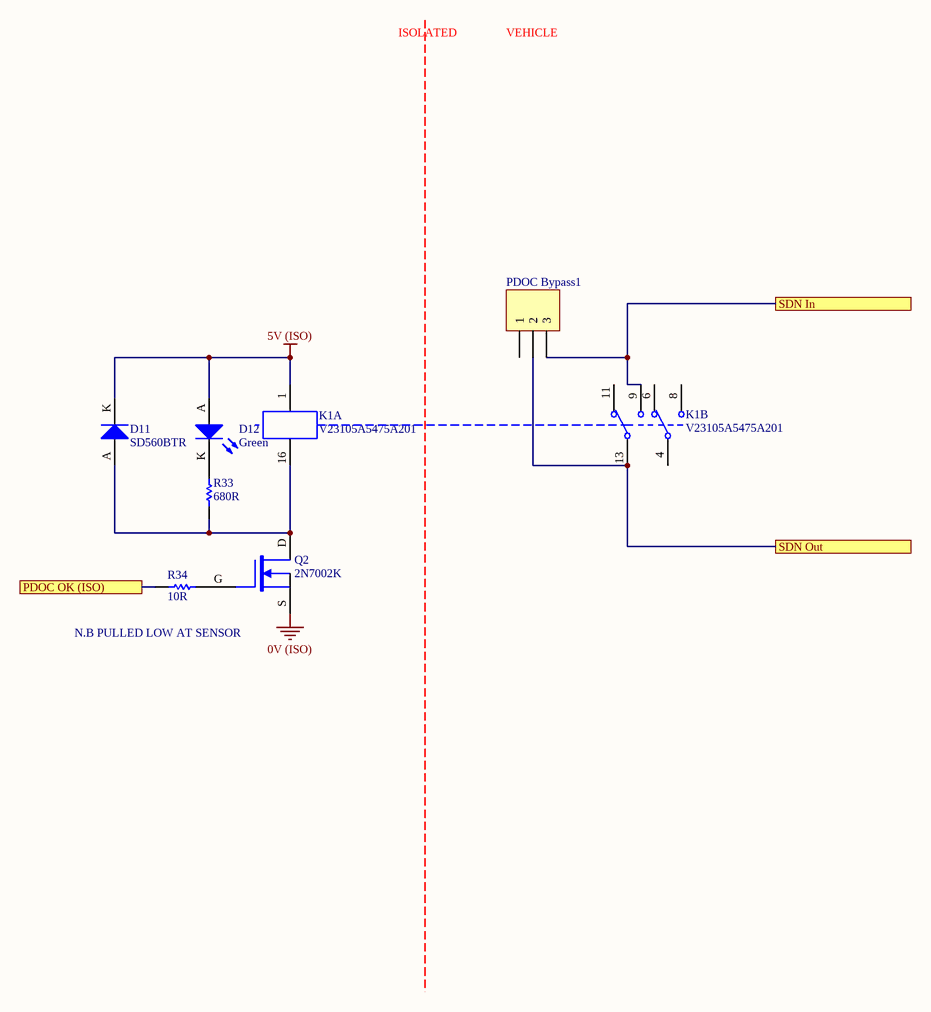
[diagram p6: Safety Loops.SchDoc]

### Parts
D11  SD560BTR  [SMB Diode]
D12  Green  [0805 LED]
K1  V23105A5475A201  [TI 2-DIL]  (parts A,B of 2)
PDOC_Bypass1  2.54mm  [TH 2.54mm Header 1x3]  (value not drawn)
Q2  2N7002K  [ON SOT-23 MOSFET]
R33  680R  [0805]
R34  10R  [0805]

### Ports
PDOC OK (ISO), SDN In, SDN Out

### Nets
0V (ISO): Q2.S
5V (ISO): D11.K D12.A K1.1
Green In: K1.13 PDOC_Bypass1.2 ; port SDN Out
Green Out: K1.9 PDOC_Bypass1.3 ; port SDN In
PDOC OK (ISO): R34.1 ; port PDOC OK (ISO)
NetD11_A: D11.A K1.16 Q2.D R33.1
NetD12_K: D12.K R33.2
NetQ2_G: Q2.G R34.2

Not connected (* = marked no-connect by the designer): K1 4 6 8 11; PDOC_Bypass1 1

### Notes on the sheet
- ISOLATED
- VEHICLE
- N.B PULLED LOW AT SENSOR

### Library data of the parts
D11 = SD560BTR: as D6 on sheet Power Supply; Part Number: SD560BTR; Digikey Part Number: 1655-1530-2-ND; Digikey Link: https://www.digikey.com/product-detail/en/smc-diode-solutions/SD560BTR/1655-1530-2-ND/6022620
D12 = SML-210FTT86: Green LED Indication - Discrete 1.75V 0805 (2012 Metric); Manufacturer: ROHM Semiconductor; Part Number: SML-210FTT86; Colour: Green; Digikey Part Number: 511-1285-1-ND; Digikey Link: https://www.digikey.com/product-detail/en/rohm-semiconductor/SML-210FTT86/511-1285-1-ND/637098
K1 = V23105A5475A201: as K2 on sheet TSAL; Part Number: V23105A5475A201; Digikey Part Number: PB383-ND; Digikey Link: https://www.digikey.com/products/en?mpart=V23105A5001A201&v=41
PDOC_Bypass1 = TH 2.54mm Header 1x3: Positions: 3; Angle: 0; Flange: No; Contact: NA; Part Number: TH 2.54mm Header 1x3; Pitch: 2.54mm; Row Spacing: 2.54mm
Q2 = 2N7002K: as Q5 on sheet TSAL; Published: 24-Mar-1999; LatestRevisionDate: 29-May-2009; LatestRevisionNote: IPC-7351 Footprint Added.; PackageVersion: Sep-2000; PackageReference: SOT-343; Publisher: Altium Limited; PackageDescription: 4-Pin SOT-343 Package 1.3 mm Pitch, 2.1 mm Lead Span; Part Number: 2N7002K; Digikey Part Number: 2N7002KCT-ND; Digikey Link: https://www.digikey.com/product-detail/en/on-semiconductor/2N7002K/2N7002KCT-ND/2060375; Qty: 30
R33 = RC0805FR07680RL: as R25 on sheet Power Supply; Part Number: RC0805FR07680RL; Value: 680R; Material: FR-07; Digikey Part Number: 311-680CRCT-ND
R34 = RC0805FR0710RL: as R75 on sheet TSAL; Part Number: RC0805FR0710RL; Value: 10R; Material: FR-07; Digikey Part Number: 311-10.0CRCT-ND

## Sheet PDOC.SchDoc
size A4
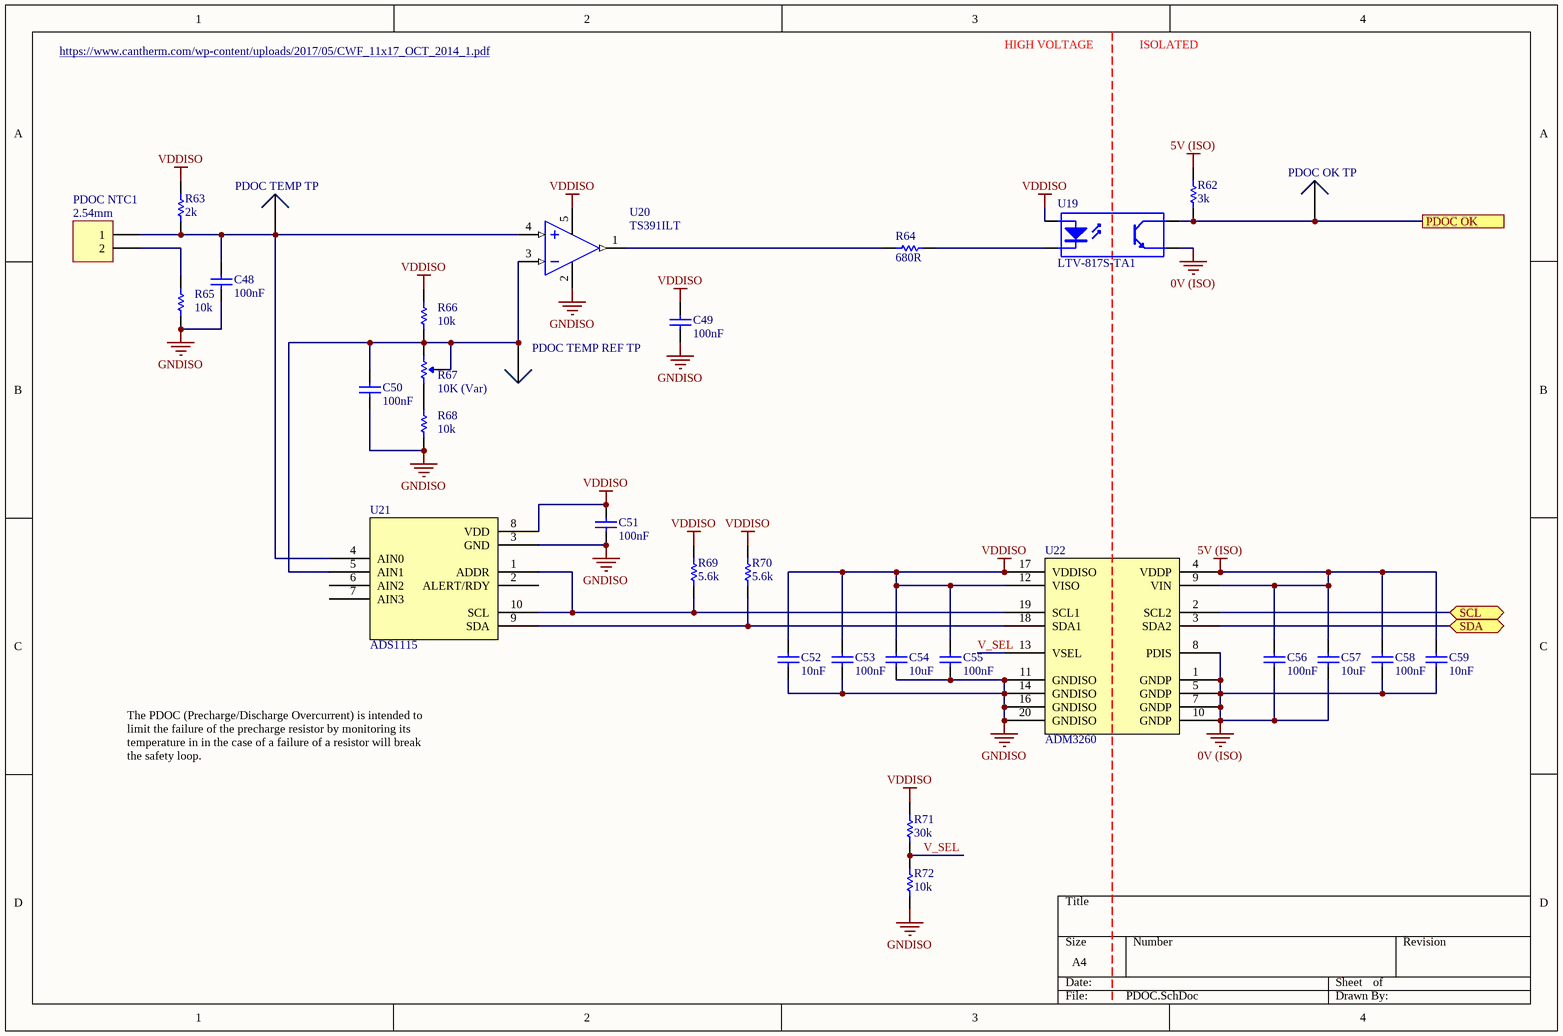
[diagram p7: PDOC.SchDoc]

### Parts
C48  100nF  [0805]
C49  100nF  [0805]
C50  100nF  [0805]
C51  100nF  [0805]
C52  10nF  [0805]
C53  100nF  [0805]
C54  10uF  [0805]
C55  100nF  [0805]
C56  100nF  [0805]
C57  10uF  [0805]
C58  100nF  [0805]
C59  10nF  [0805]
PDOC_NTC1  2.54mm  [TH 2.54mm Header 1x2]
PDOC_OK_TP  0mm  [SMD Test Point]  (value not drawn)
PDOC_TEMP_REF_TP  0mm  [SMD Test Point]  (value not drawn)
PDOC_TEMP_TP  0mm  [SMD Test Point]  (value not drawn)
R62  3k  [0805]
R63  2k  [0805]
R64  680R  [0805]
R65  10k  [0805]
R66  10k  [0805]
R67  10K (Var)  [B 3296]
R68  10k  [0805]
R69  5.6k  [0805]
R70  5.6k  [0805]
R71  30k  [0805]
R72  10k  [0805]
U19  LTV-817S-TA1  [ON 4-SMD]
U20  TS391ILT  [ON SOT-23-5]
U21  ADS1115  [TI 10-VSSOP]
U22  ADM3260  [AD 20-SSOP]

### Ports
PDOC OK, SCL (bidir), SDA (bidir)

### Nets
0V (ISO): C56.1 C57.1 C58.1 C59.1 U19.3(E) U22.1(GNDP) U22.5(GNDP) U22.7(GNDP) U22.8(PDIS) U22.10(GNDP)
5V (ISO): C56.2 C57.2 C58.2 C59.2 R62.2 U22.4(VDDP) U22.9(VIN)
GNDISO: C48.1 C49.1 C50.1 C51.1 C52.1 C53.1 C54.1 C55.1 R65.1 R68.1 R72.1 U20.2(VCC-) U21.3(GND) U22.11(GNDISO) U22.14(GNDISO) U22.16(GNDISO) U22.20(GNDISO)
VDDISO: C49.2 C51.2 C52.2 C53.2 C54.2 C55.2 R63.2 R66.2 R69.2 R70.2 R71.2 U19.1(A) U20.5(VCC+) U21.8(VDD) U22.12(VISO) U22.17(VDDISO)
PDOC OK (ISO): PDOC_OK_TP.1 R62.1 U19.4(C) ; port PDOC OK
SCL: U22.2(SCL2) ; port SCL
SDA: U22.3(SDA2) ; port SDA
V_SEL: R71.1 R72.2 U22.13(VSEL)
NetC48_2: C48.2 PDOC_NTC1.1 PDOC_TEMP_TP.1 R63.1 U20.4(IIN+) U21.4(AIN0)
NetC50_2: C50.2 PDOC_TEMP_REF_TP.1 R66.1 R67.1(CCW) R67.2(Wiper) U20.3(IN-) U21.5(AIN1)
NetPDOC_NTC1_2: PDOC_NTC1.2 R65.2
NetR64_1: R64.1 U20.1(OUT)
NetR64_2: R64.2 U19.2(K)
NetR67_3: R67.3(CW) R68.2
NetR69_1: R69.1 U21.1(ADDR) U21.10(SCL) U22.19(SCL1)
NetR70_1: R70.1 U21.9(SDA) U22.18(SDA1)

Not connected (* = marked no-connect by the designer): U21 2(ALERT/RDY) 6(AIN2) 7(AIN3)

### Notes on the sheet
- https://www.cantherm.com/wp-content/uploads/2017/05/CWF_11x17_OCT_2014_1.pdf
- HIGH VOLTAGE
- ISOLATED
- The PDOC (Precharge/Discharge Overcurrent) is intended to limit the failure of the precharge resistor by monitoring its temperature in in the case of a failure of a resistor will break the safety loop.

### Library data of the parts
C48-C51 C53 C55 C56 C58 = GCM21BR71H104KA37L: as C2 on sheet CAN; Part Number: GCM21BR71H104KA37L; Value: 100nF; Digikey Part Number: 490-6064-1-ND
C52 C59 = GCM21BR71H103KA37L: Manufacturer: muRata; Tolerance: 10%; Material: X7R; Rated Voltage: 50V; Part Number: GCM21BR71H103KA37L; Value: 10nF
C54 C57 = GRM21BR6YA106KE43L: as C5 on sheet CAN; Part Number: GRM21BR6YA106KE43L; Value: 10uF; Digikey Part Number: 490-10514-6-ND
PDOC_NTC1 = TH 2.54mm Header 1x2: Positions: 2; Angle: 0; Flange: No; Contact: NA; Part Number: TH 2.54mm Header 1x2; Pitch: 2.54mm; Row Spacing: 2.54mm
PDOC_OK_TP PDOC_TEMP_REF_TP PDOC_TEMP_TP = SMD Test Point: as 0V_ISO_TP on sheet Power Supply; Part Number: SMD Test Point; Pitch: 0mm; Angle: 0
R62 = RC0805FR073KL: Manufacturer: YAGEO; Tolerance: 0.01; Rated Voltage: 0.125W; Part Number: RC0805FR073KL; Value: 3k; Material: FR-07; Digikey Part Number: 311-3.00KCRCT-ND
R63 = RC0805FR072KL: Manufacturer: YAGEO; Tolerance: 0.01; Rated Voltage: 0.125W; Part Number: RC0805FR072KL; Value: 2k; Material: FR-07; Digikey Part Number: 311-2.00KCRCT-ND
R64 = RC0805FR07680RL: as R25 on sheet Power Supply; Part Number: RC0805FR07680RL; Value: 680R; Material: FR-07; Digikey Part Number: 311-680CRCT-ND
R65 R66 R68 R72 = RC0805FR0710KL: as R10 on sheet Microcontroller; Part Number: RC0805FR0710KL; Value: 10k; Material: FR-07; Digikey Part Number: 311-10.0KCRCT-ND
R67 = 3296W-1-103LF: as R76 on sheet TSAL; Part Number: 3296W-1-103LF; Value: 10K (Var); Digikey Part Number: 3296W-103LF-ND
R69 R70 = RC0805FR075K6L: Manufacturer: YAGEO; Tolerance: 0.01; Rated Voltage: 0.125W; Part Number: RC0805FR075K6L; Value: 5.6k; Material: FR-07; Digikey Part Number: 311-5.60KCRCT-ND
R71 = RC0805FR0730KL: Manufacturer: YAGEO; Tolerance: 0.01; Rated Voltage: 0.125W; Part Number: RC0805FR0730KL; Value: 30k; Material: FR-07; Digikey Part Number: 311-30.0KCRCT-ND
U19 = LTV-817S-TA1: as U5 on sheet Discharge; Part Number: LTV-817S-TA1; Digikey Part Number: 160-1893-2-ND; Digikey Link: https://www.digikey.com/product-detail/en/lite-on-inc/LTV-817S-TA1/160-1893-2-ND/388451
U20 = TS391ILT: IC COMP LO PWR SGL V SOT 23-5L; Manufacturer: STMicroelectronics; Part Number: TS391ILT; Digikey Part Number: 497-2275-2-ND; Digikey Link: https://www.digikey.com/product-detail/en/stmicroelectronics/TS391ILT/497-2275-2-ND/599407
U21 = ADS1115: 16 Bit Analog to Digital Converter 2, 4 Input 1 Sigma-Delta 10-VSSOP; Manufacturer: Texas Instruments; Part Number: ADS1115; Digikey Part Number: 296-38849-1-ND; Digikey Link: https://www.digikey.com/product-detail/en/texas-instruments/ADS1115IDGSR/296-38849-1-ND/5142969
U22 = ADM3260: I²C Digital Isolator 2500Vrms 2 Channel 25kV/µs CMTI 20-SSOP (0.209", 5.30mm Width); Manufacturer: Analog Devices; Part Number: ADM3260; Digikey Part Number: ADM3260ARSZ-RL7CT-ND; Digikey Link: https://www.digikey.com/product-detail/en/analog-devices-inc/ADM3260ARSZ-RL7/ADM3260ARSZ-RL7CT-ND/5233040

## Sheet HV Sense.SchDoc
size A4
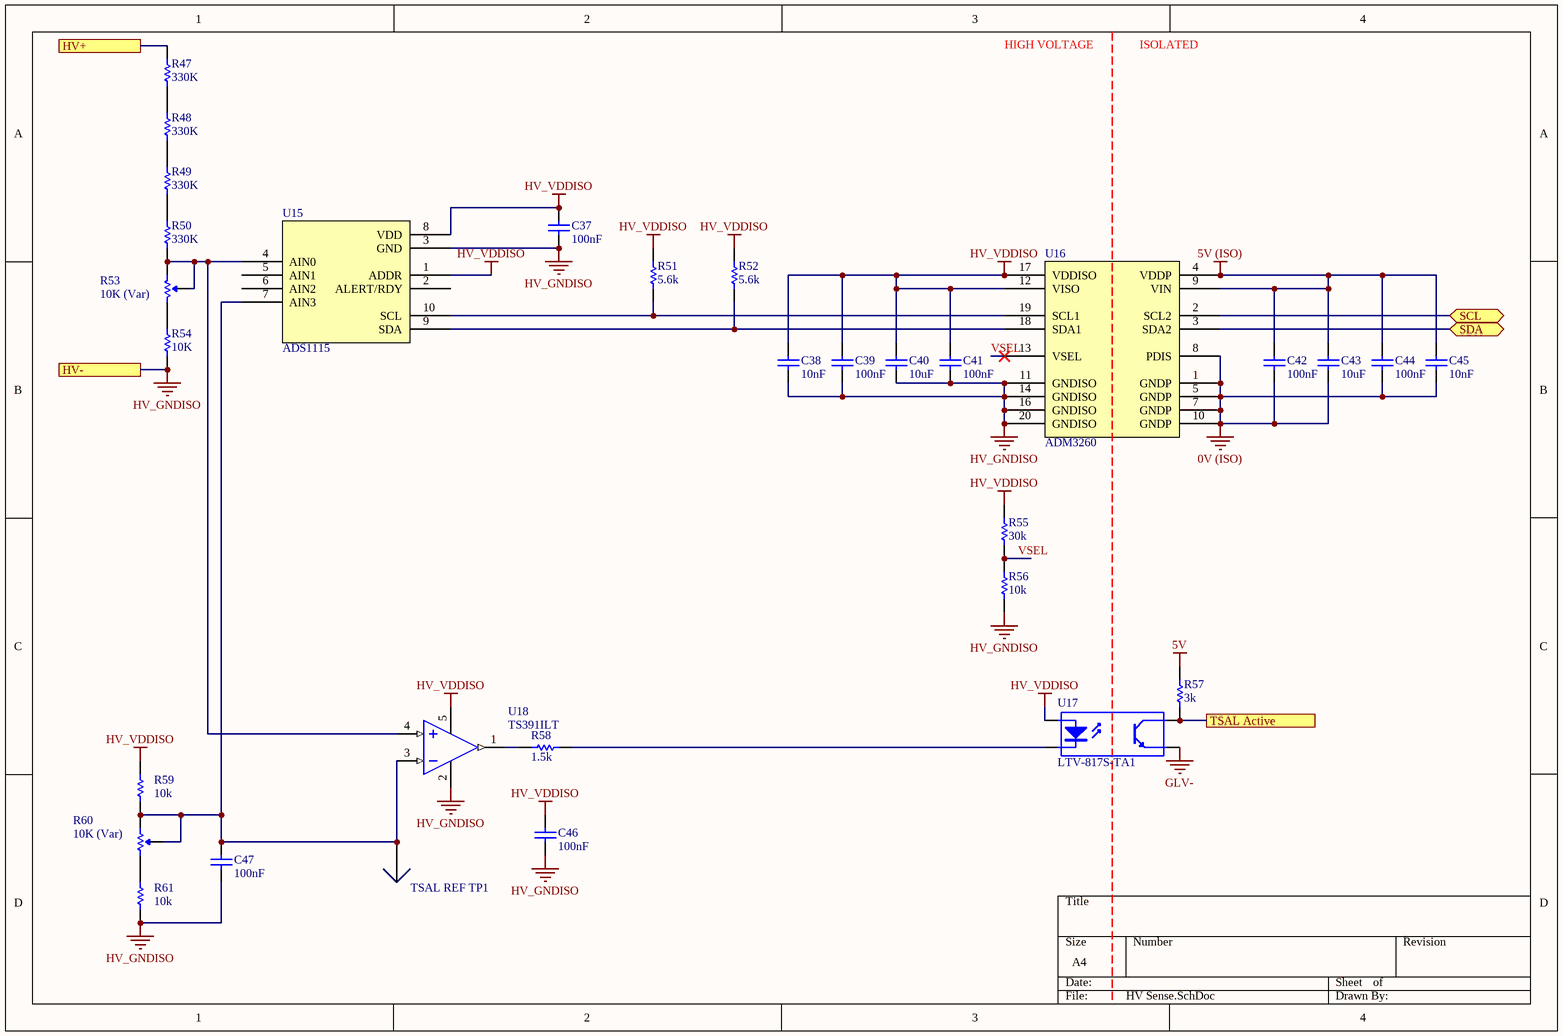
[diagram p8: HV Sense.SchDoc]

### Parts
C37  100nF  [0805]
C38  10nF  [0805]
C39  100nF  [0805]
C40  10uF  [0805]
C41  100nF  [0805]
C42  100nF  [0805]
C43  10uF  [0805]
C44  100nF  [0805]
C45  10nF  [0805]
C46  100nF  [0805]
C47  100nF  [0805]
R47  330K  [VB 0204]
R48  330K  [VB 0204]
R49  330K  [VB 0204]
R50  330K  [VB 0204]
R51  5.6k  [0805]
R52  5.6k  [0805]
R53  10K (Var)  [B 3296]
R54  10K  [VB 0204]
R55  30k  [0805]
R56  10k  [0805]
R57  3k  [0805]
R58  1.5k  [0805]
R59  10k  [0805]
R60  10K (Var)  [B 3296]
R61  10k  [0805]
TSAL_REF_TP1  0mm  [TH Test Point]  (value not drawn)
U15  ADS1115  [TI 10-VSSOP]
U16  ADM3260  [AD 20-SSOP]
U17  LTV-817S-TA1  [ON 4-SMD]
U18  TS391ILT  [ON SOT-23-5]

### Ports
HV+, HV-, SCL (bidir), SDA (bidir), TSAL Active

### Nets
0V (ISO): C42.1 C43.1 C44.1 C45.1 U16.1(GNDP) U16.5(GNDP) U16.7(GNDP) U16.8(PDIS) U16.10(GNDP)
5V: R57.2
5V (ISO): C42.2 C43.2 C44.2 C45.2 U16.4(VDDP) U16.9(VIN)
GLV-: U17.3(E)
HV_GNDISO: C37.1 C38.1 C39.1 C40.1 C41.1 C46.1 C47.1 R54.1 R56.1 R61.1 U15.3(GND) U16.11(GNDISO) U16.14(GNDISO) U16.16(GNDISO) U16.20(GNDISO) U18.2(VCC-) ; port HV-  [project net HV MC-]
HV_VDDISO: C37.2 C38.2 C39.2 C40.2 C41.2 C46.2 R51.2 R52.2 R55.2 R59.2 U15.1(ADDR) U15.8(VDD) U16.12(VISO) U16.17(VDDISO) U17.1(A) U18.5(VCC+)
HV MC+: R47.2 ; port HV+
SCL: U16.2(SCL2) ; port SCL
SDA: U16.3(SDA2) ; port SDA
TSAL Active: R57.1 U17.4(C) ; port TSAL Active
VSEL: R55.1 R56.2 U16.13(VSEL)
NetC47_2: C47.2 R59.1 R60.1(CCW) R60.2(Wiper) TSAL_REF_TP1.1 U15.7(AIN3) U18.3(IN-)
NetR47_1: R47.1 R48.2
NetR48_1: R48.1 R49.2
NetR49_1: R49.1 R50.2
NetR50_1: R50.1 R53.2(Wiper) R53.3(CW) U15.4(AIN0) U18.4(IIN+)
NetR51_1: R51.1 U15.10(SCL) U16.19(SCL1)
NetR52_1: R52.1 U15.9(SDA) U16.18(SDA1)
NetR53_1: R53.1(CCW) R54.2
NetR58_1: R58.1 U18.1(OUT)
NetR58_2: R58.2 U17.2(K)
NetR60_3: R60.3(CW) R61.2

Not connected (* = marked no-connect by the designer): U15 2(ALERT/RDY) 5(AIN1) 6(AIN2)

### Notes on the sheet
- HIGH VOLTAGE
- ISOLATED

### Library data of the parts
C37 C39 C41 C42 C44 C46 C47 = GCM21BR71H104KA37L: as C2 on sheet CAN; Part Number: GCM21BR71H104KA37L; Value: 100nF; Digikey Part Number: 490-6064-1-ND
C38 C45 = GCM21BR71H103KA37L: as C52 on sheet PDOC; Part Number: GCM21BR71H103KA37L; Value: 10nF
C40 C43 = GRM21BR6YA106KE43L: as C5 on sheet CAN; Part Number: GRM21BR6YA106KE43L; Value: 10uF; Digikey Part Number: 490-10514-6-ND
R47-R50 = MMA02040C3303FB300: Manufacturer: Vishay Beyschlag; Tolerance: 0.01; Rated Voltage: 0.4W; Part Number: MMA02040C3303FB300; Value: 330K; Digikey Part Number: MMA-330KACT-ND
R51 R52 = RC0805FR075K6L: as R69 on sheet PDOC; Part Number: RC0805FR075K6L; Value: 5.6k; Material: FR-07; Digikey Part Number: 311-5.60KCRCT-ND
R53 R60 = 3296W-1-103LF: as R76 on sheet TSAL; Part Number: 3296W-1-103LF; Value: 10K (Var); Digikey Part Number: 3296W-103LF-ND
R54 = MMA02040C1002FB300: Manufacturer: Vishay Beyschlag; Tolerance: 0.01; Rated Voltage: 0.4W; Part Number: MMA02040C1002FB300; Value: 10K; Digikey Part Number: MMA-10KACT-ND
R55 = RC0805FR0730KL: as R71 on sheet PDOC; Part Number: RC0805FR0730KL; Value: 30k; Material: FR-07; Digikey Part Number: 311-30.0KCRCT-ND
R56 R59 R61 = RC0805FR0710KL: as R10 on sheet Microcontroller; Part Number: RC0805FR0710KL; Value: 10k; Material: FR-07; Digikey Part Number: 311-10.0KCRCT-ND
R57 = RC0805FR073KL: as R62 on sheet PDOC; Part Number: RC0805FR073KL; Value: 3k; Material: FR-07; Digikey Part Number: 311-3.00KCRCT-ND
R58 = RC0805FR071K5L: as R19 on sheet Microcontroller; Part Number: RC0805FR071K5L; Value: 1.5k; Material: FR-07; Digikey Part Number: 311-1.50KCRCT-ND
TSAL_REF_TP1 = TH Test Point: as TSAL_CLK_TP_THT on sheet TSAL; Part Number: TH Test Point; Pitch: 0mm; Row Spacing: 0mm
U15 = ADS1115: as U21 on sheet PDOC; Part Number: ADS1115; Digikey Part Number: 296-38849-1-ND; Digikey Link: https://www.digikey.com/product-detail/en/texas-instruments/ADS1115IDGSR/296-38849-1-ND/5142969
U16 = ADM3260: as U22 on sheet PDOC; Part Number: ADM3260; Digikey Part Number: ADM3260ARSZ-RL7CT-ND; Digikey Link: https://www.digikey.com/product-detail/en/analog-devices-inc/ADM3260ARSZ-RL7/ADM3260ARSZ-RL7CT-ND/5233040
U17 = LTV-817S-TA1: as U5 on sheet Discharge; Part Number: LTV-817S-TA1; Digikey Part Number: 160-1893-2-ND; Digikey Link: https://www.digikey.com/product-detail/en/lite-on-inc/LTV-817S-TA1/160-1893-2-ND/388451
U18 = TS391ILT: as U20 on sheet PDOC; Part Number: TS391ILT; Digikey Part Number: 497-2275-2-ND; Digikey Link: https://www.digikey.com/product-detail/en/stmicroelectronics/TS391ILT/497-2275-2-ND/599407

## Nets that join several sheets
0V (ISO): CAN (9 pins), Power Supply (0V_ISO_TP.1 C31.1 R26.1 U9.16), Microcontroller (33 pins), Discharge (Q1.S U5.3), Safety Loops (Q2.S), PDOC (10 pins), HV Sense (9 pins)
5V: Top Level (SECONDARY_INTERFACE.1), Power Supply (5V_TP.1 C28.2 D7.A U8.3), TSAL (7 pins), Discharge (R6.2), HV Sense (R57.2)
5V (ISO): CAN (6 pins), Power Supply (5V_ISO_TP.1 C31.2 D8.A U9.14), Microcontroller (10 pins), Discharge (D1.K R4.2 R7.2 U4.2), Safety Loops (D11.K D12.A K1.1), PDOC (7 pins), HV Sense (6 pins)
GLV-: Top Level (UNIVERSAL_INTERFACE.11), Power Supply (8 pins), TSAL (6 pins), HV Sense (U17.3)
HV MC-: Top Level (HV_MC-1.1 HV_MC-1.2 R30.2), Discharge (R5.2), HV Sense (16 pins)
CAN1H: Top Level (UNIVERSAL_INTERFACE.5), CAN (C11.2 CAN_TERM_R1.2 TP?#4.1 U2.2)
CAN1L: Top Level (UNIVERSAL_INTERFACE.4), CAN (C10.2 CAN_TERM_R2.1 TP?#3.1 U2.1)
CAN RX: CAN (U1.4), Microcontroller (R27.1 U6.45)
CAN TX: CAN (U1.5), Microcontroller (R28.1 U6.46)
CANS: Top Level (UNIVERSAL_INTERFACE.1), CAN (15 pins)
Discharge Disable (ISO): Microcontroller (U6.28), Discharge (DIS_SIG_ISO_TP.1 R7.1 R8.1 U5.4)
Discharge Release: Top Level (SECONDARY_INTERFACE.2), Discharge (DIS_SIG_TP.1 U5.2)
GLV+: Top Level (UNIVERSAL_INTERFACE.12), Power Supply (F1.1 GLV+_TP.1)
Green In: Top Level (UNIVERSAL_INTERFACE.10), Safety Loops (K1.13 PDOC_Bypass1.2)
Green Out: Top Level (UNIVERSAL_INTERFACE.9), Safety Loops (K1.9 PDOC_Bypass1.3)
HV MC+: Top Level (HV_MC+1.1 HV_MC+1.2 R29.2), Discharge (R3.1), HV Sense (R47.2)
PDOC OK (ISO): Microcontroller (U6.22), Safety Loops (R34.1), PDOC (PDOC_OK_TP.1 R62.1 U19.4)
SCL: Microcontroller (R16.1 U6.42), PDOC (U22.2), HV Sense (U16.2)
SDA: Microcontroller (R17.1 U6.43), PDOC (U22.3), HV Sense (U16.3)
TSAL Active: TSAL (R78.1 TSAL_RELAY_TP.1), HV Sense (R57.1 U17.4)
TSAL Green: Top Level (SECONDARY_INTERFACE.3), TSAL (K2.6)
TSAL Red: Top Level (SECONDARY_INTERFACE.4), TSAL (Q4.D R73.1)